# Altium project openbook.PrjPCB (part 2 of 4)

## Sheet p04_cpu_2_of_3_usb_serial.SchDoc
size 520 x 386 mm
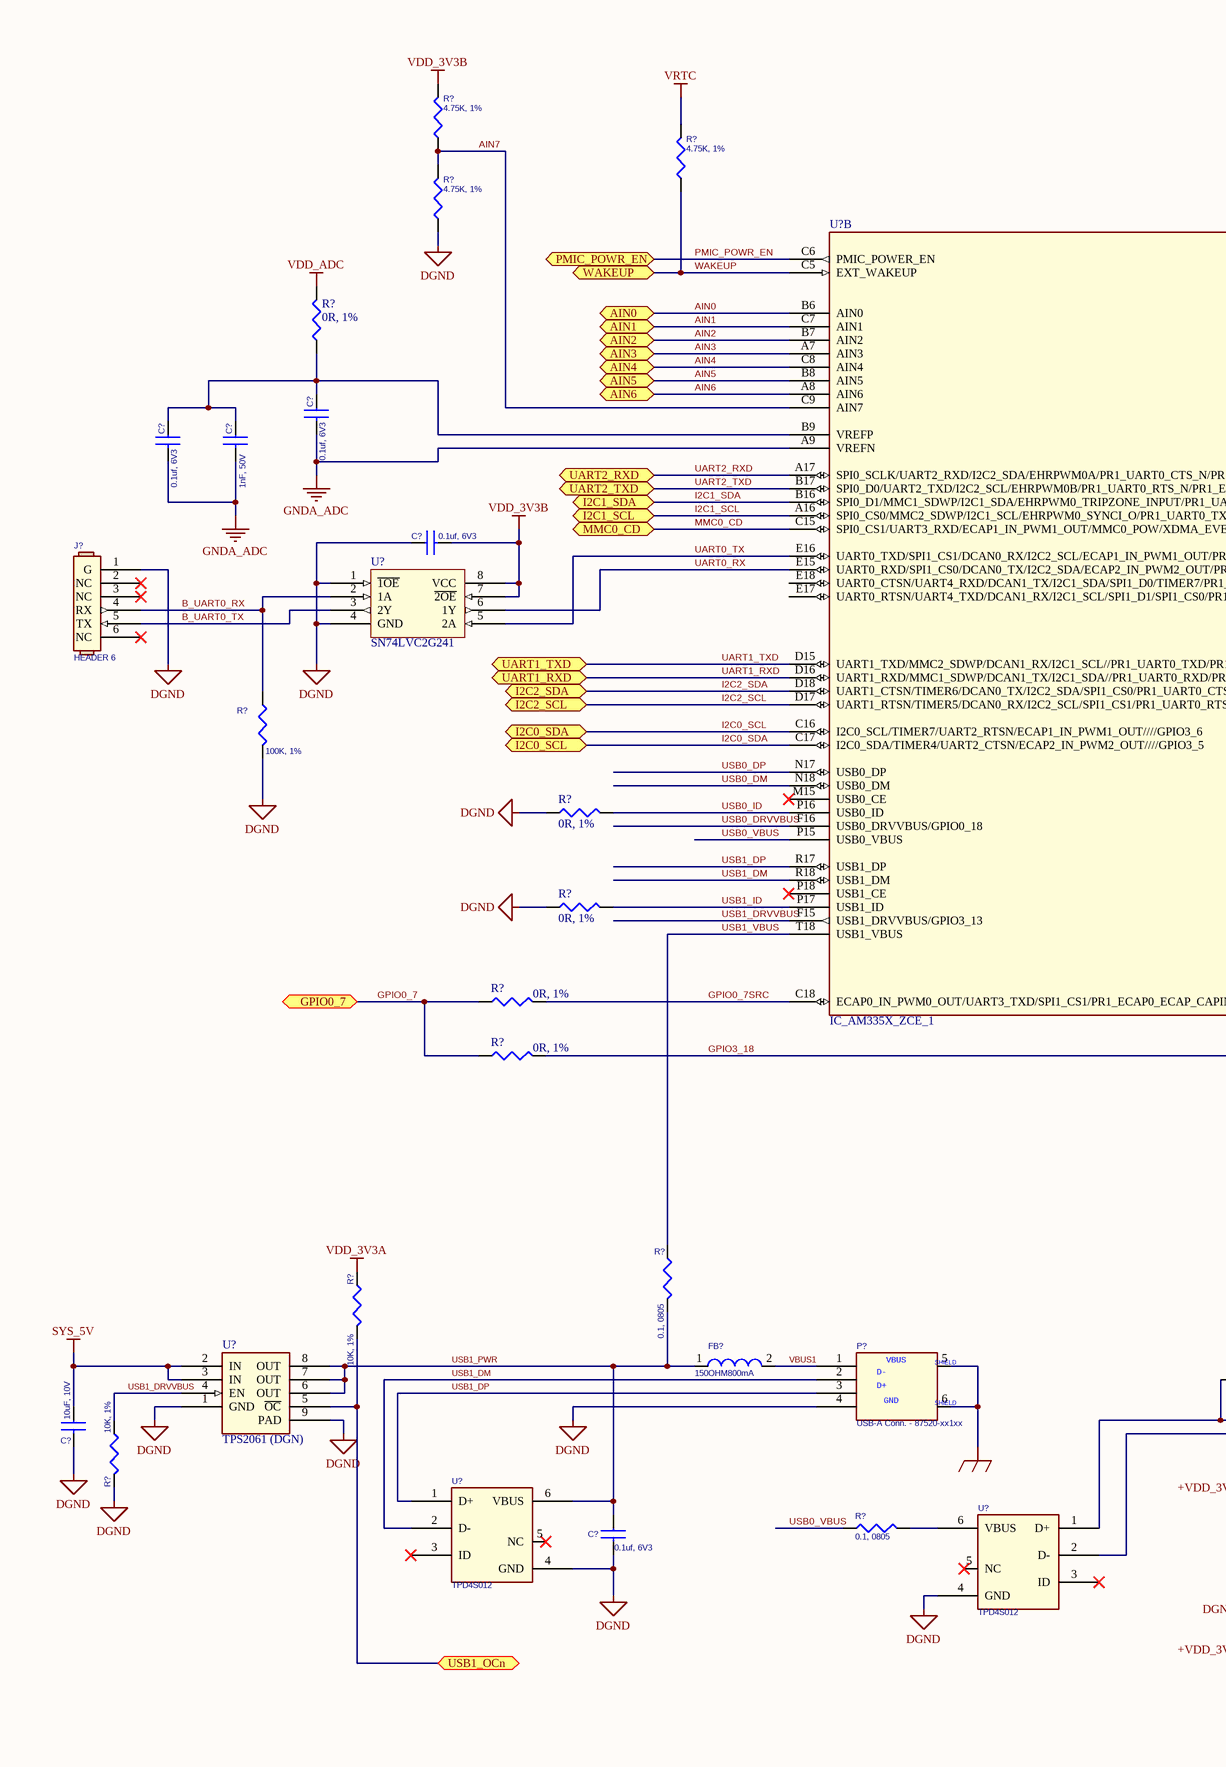
[diagram p3: p04_cpu_2_of_3_usb_serial.SchDoc, left]
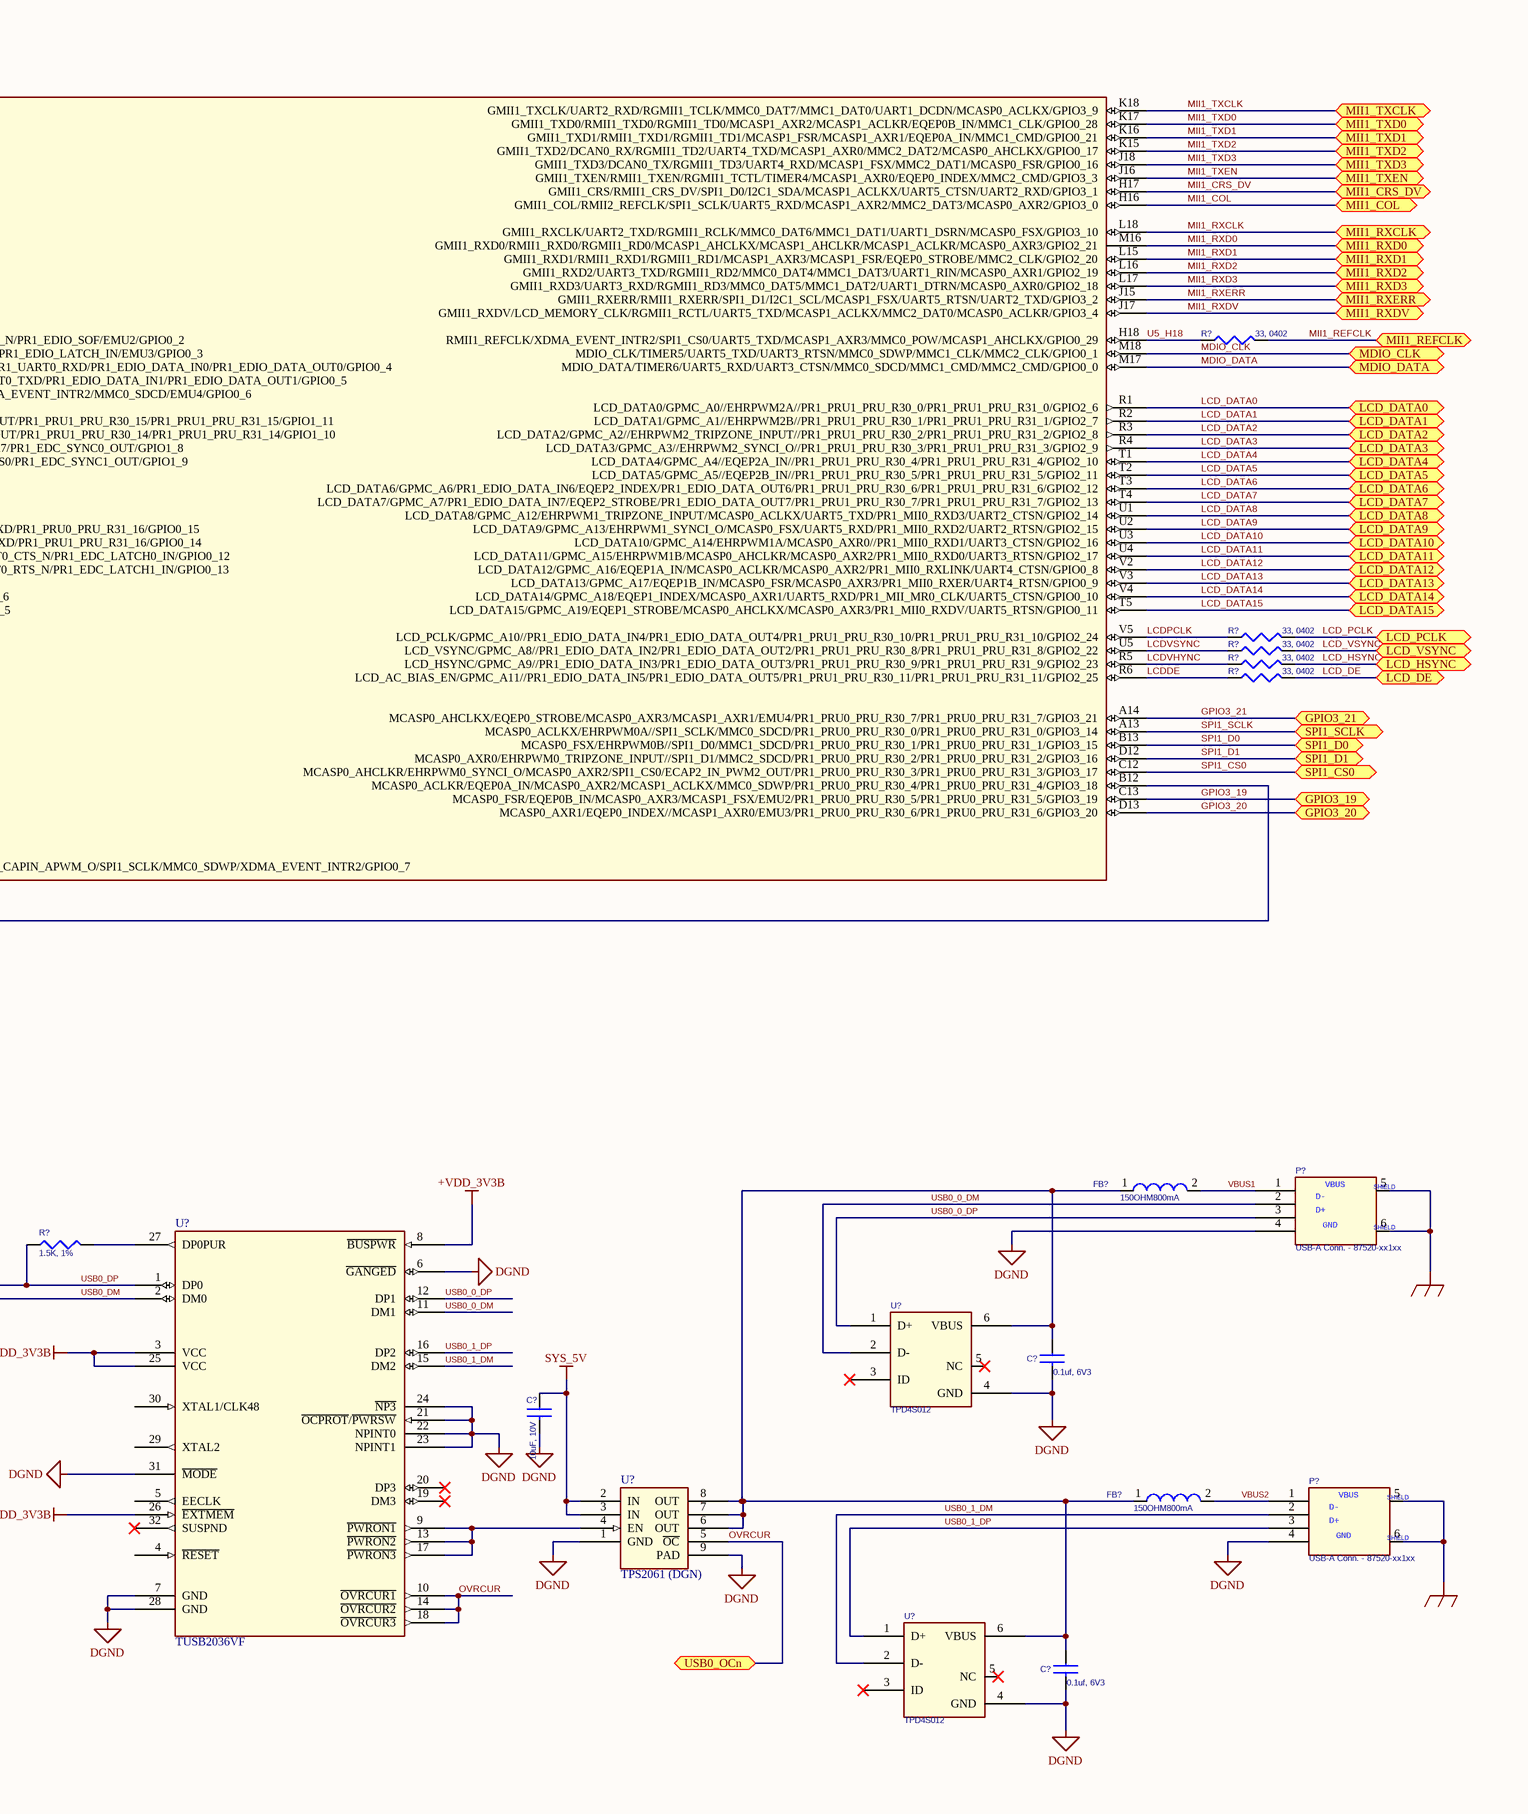
[diagram p4: p04_cpu_2_of_3_usb_serial.SchDoc, right]

### Parts
(Parts that share a designator on the sheet are numbered #1, #2 ... from top to bottom, then left to right.)
C?#29  0.1uf, 6V3  [402]
C?#30  0.1uf, 6V3  [402]
C?#31  1nF, 50V  [402]
C?#32  0.1uf, 6V3  [402]
C?#33  10uF, 10V  [805]
C?#34  0.1uf, 6V3  [402]
C?#35  0.1uf, 6V3  [402]
C?#36  10uF, 10V  [805]
C?#37  0.1uf, 6V3  [402]
FB?#1  150OHM800mA  [SM-7351-IND-0805]
FB?#2  150OHM800mA  [SM-7351-IND-0805]
FB?#3  150OHM800mA  [SM-7351-IND-0805]
J?  HEADER 6  [SIP6]
P?#3  USB-A Conn. - 87520-xx1xx  [usb_a_sh]
P?#4  USB-A Conn. - 87520-xx1xx  [usb_a_sh]
P?#5  USB-A Conn. - 87520-xx1xx  [usb_a_sh]
R?#26  4.75K, 1%  [402]
R?#27  4.75K, 1%  [402]
R?#28  4.75K, 1%  [402]
R?#29  0R, 1%  [402]
R?#30  33, 0402  [402]
R?#31  100K, 1%  [402]
R?#32  33, 0402  [402]
R?#33  33, 0402  [402]
R?#34  33, 0402  [402]
R?#35  0R, 1%  [402]
R?#36  33, 0402  [402]
R?#37  0R, 1%  [402]
R?#38  0R, 1%  [402]
R?#39  0R, 1%  [402]
R?#40  0.1, 0805  [805]
R?#41  10K, 1%  [402]
R?#42  1.5K, 1%  [402]
R?#43  10K, 1%  [402]
R?#44  0.1, 0805  [805]
U?#6  IC_AM335X_ZCE_1  [am33xx_15x15]  (part B of 3)
U?#7  SN74LVC2G241  [U_8_DCU]
U?#8  TPS2061 (DGN)  [DGN-16X60]
U?#9  TUSB2036VF  [LQFP32]
U?#10  TPD4S012  [U_6_DRY]
U?#11  TPD4S012  [U_6_DRY]
U?#12  TPD4S012  [U_6_DRY]
U?#13  TPS2061 (DGN)  [DGN-16X60]
U?#14  TPD4S012  [U_6_DRY]

### Ports
AIN0, AIN1, AIN2, AIN3, AIN4, AIN5, AIN6, GPIO0_7, GPIO3_19, GPIO3_20, GPIO3_21, I2C0_SCL, I2C0_SDA, I2C1_SCL, I2C1_SDA, I2C2_SCL, I2C2_SDA, LCD_DATA0, LCD_DATA1, LCD_DATA2, LCD_DATA3, LCD_DATA4, LCD_DATA5, LCD_DATA6, LCD_DATA7, LCD_DATA8, LCD_DATA9, LCD_DATA10, LCD_DATA11, LCD_DATA12, LCD_DATA13, LCD_DATA14, LCD_DATA15, LCD_DE, LCD_HSYNC, LCD_PCLK, LCD_VSYNC, MDIO_CLK, MDIO_DATA, MII1_COL, MII1_CRS_DV, MII1_REFCLK, MII1_RXCLK, MII1_RXD0, MII1_RXD1, MII1_RXD2, MII1_RXD3, MII1_RXDV, MII1_RXERR, MII1_TXCLK, MII1_TXD0, MII1_TXD1, MII1_TXD2, MII1_TXD3, MII1_TXEN, MMC0_CD, PMIC_POWR_EN, SPI1_CS0, SPI1_D0, SPI1_D1, SPI1_SCLK, UART1_RXD, UART1_TXD, UART2_RXD, UART2_TXD, USB0_OCn, USB1_OCn, WAKEUP

### Nets
+VDD_3V3B: U?#9.3(VCC) U?#9.8(~{BUSPWR}) U?#9.25(VCC) U?#9.26(~{EXTMEM})
DGND: C?#32.1 C?#33.2 C?#34.2 C?#35.2 C?#36.2 C?#37.2 J?.1(G) P?#3.4(P4) P?#4.4(P4) P?#5.4(P4) R?#28.1 R?#31.2 R?#35.1 R?#37.1 R?#43.2 U?#7.1(~{1OE}) U?#7.4(GND) U?#8.1(GND) U?#8.9(PAD) U?#9.6(~{GANGED}) U?#9.7(GND) U?#9.21(~{OCPROT}/~{PWRSW}) U?#9.22(NPINT0) U?#9.23(NPINT1) U?#9.24(~{NP3}) U?#9.28(GND) U?#9.31(~{MODE}) U?#10.4(GND) U?#11.4(GND) U?#12.4(GND) U?#13.1(GND) U?#13.9(PAD) U?#14.4(GND)
GND_EARTH: P?#3.5(SHELD1) P?#3.6(PAD4) P?#4.5(SHELD1) P?#4.6(PAD4) P?#5.5(SHELD1) P?#5.6(PAD4)
GNDA_ADC: C?#29.2 C?#30.2 C?#31.2 U?#6.A9(VREFN)
SYS_5V: C?#33.1 C?#36.1 U?#8.2(IN) U?#8.3(IN) U?#13.2(IN) U?#13.3(IN)
VDD_3V3A: R?#41.1
VDD_3V3B: C?#32.2 R?#26.2 U?#7.7(~{2OE}) U?#7.8(VCC)
VDD_ADC: R?#29.2
VRTC: R?#27.2
AIN0: U?#6.B6(AIN0) ; port AIN0
AIN1: U?#6.C7(AIN1) ; port AIN1
AIN2: U?#6.B7(AIN2) ; port AIN2
AIN3: U?#6.A7(AIN3) ; port AIN3
AIN4: U?#6.C8(AIN4) ; port AIN4
AIN5: U?#6.B8(AIN5) ; port AIN5
AIN6: U?#6.A8(AIN6) ; port AIN6
AIN7: R?#26.1 R?#28.2 U?#6.C9(AIN7)
B_UART0_RX: J?.4(RX) R?#31.1 U?#7.2(1A)
B_UART0_TX: J?.5(TX) U?#7.3(2Y)
GPIO0_7: R?#38.1 R?#39.1 ; port GPIO0_7
GPIO0_7SRC: R?#38.2 U?#6.C18(ECAP0_IN_PWM0_OUT/UART3_TXD/SPI1_CS1/PR1_ECAP0_ECAP_CAPIN_APWM_O/SPI1_SCLK/MMC0_SDWP/XDMA_EVENT_INTR2/GPIO0_7)
GPIO3_18: R?#39.2 U?#6.B12(MCASP0_ACLKR/EQEP0A_IN/MCASP0_AXR2/MCASP1_ACLKX/MMC0_SDWP/PR1_PRU0_PRU_R30_4/PR1_PRU0_PRU_R31_4/GPIO3_18)
GPIO3_19: U?#6.C13(MCASP0_FSR/EQEP0B_IN/MCASP0_AXR3/MCASP1_FSX/EMU2/PR1_PRU0_PRU_R30_5/PR1_PRU0_PRU_R31_5/GPIO3_19) ; port GPIO3_19
GPIO3_20: U?#6.D13(MCASP0_AXR1/EQEP0_INDEX//MCASP1_AXR0/EMU3/PR1_PRU0_PRU_R30_6/PR1_PRU0_PRU_R31_6/GPIO3_20) ; port GPIO3_20
GPIO3_21: U?#6.A14(MCASP0_AHCLKX/EQEP0_STROBE/MCASP0_AXR3/MCASP1_AXR1/EMU4/PR1_PRU0_PRU_R30_7/PR1_PRU0_PRU_R31_7/GPIO3_21) ; port GPIO3_21
I2C0_SCL: U?#6.C16(I2C0_SCL/TIMER7/UART2_RTSN/ECAP1_IN_PWM1_OUT////GPIO3_6) ; port I2C0_SDA
I2C0_SDA: U?#6.C17(I2C0_SDA/TIMER4/UART2_CTSN/ECAP2_IN_PWM2_OUT////GPIO3_5) ; port I2C0_SCL  [project net I2C0_SCL]
I2C1_SCL: U?#6.A16(SPI0_CS0/MMC2_SDWP/I2C1_SCL/EHRPWM0_SYNCI_O/PR1_UART0_TXD/PR1_EDIO_DATA_IN1/PR1_EDIO_DATA_OUT1/GPIO0_5) ; port I2C1_SCL
I2C1_SDA: U?#6.B16(SPI0_D1/MMC1_SDWP/I2C1_SDA/EHRPWM0_TRIPZONE_INPUT/PR1_UART0_RXD/PR1_EDIO_DATA_IN0/PR1_EDIO_DATA_OUT0/GPIO0_4) ; port I2C1_SDA
I2C2_SCL: U?#6.D17(UART1_RTSN/TIMER5/DCAN0_RX/I2C2_SCL/SPI1_CS1/PR1_UART0_RTS_N/PR1_EDC_LATCH1_IN/GPIO0_13) ; port I2C2_SCL
I2C2_SDA: U?#6.D18(UART1_CTSN/TIMER6/DCAN0_TX/I2C2_SDA/SPI1_CS0/PR1_UART0_CTS_N/PR1_EDC_LATCH0_IN/GPIO0_12) ; port I2C2_SDA
LCD_DATA0: U?#6.R1(LCD_DATA0/GPMC_A0//EHRPWM2A//PR1_PRU1_PRU_R30_0/PR1_PRU1_PRU_R31_0/GPIO2_6) ; port LCD_DATA0
LCD_DATA1: U?#6.R2(LCD_DATA1/GPMC_A1//EHRPWM2B//PR1_PRU1_PRU_R30_1/PR1_PRU1_PRU_R31_1/GPIO2_7) ; port LCD_DATA1
LCD_DATA2: U?#6.R3(LCD_DATA2/GPMC_A2//EHRPWM2_TRIPZONE_INPUT//PR1_PRU1_PRU_R30_2/PR1_PRU1_PRU_R31_2/GPIO2_8) ; port LCD_DATA2
LCD_DATA3: U?#6.R4(LCD_DATA3/GPMC_A3//EHRPWM2_SYNCI_O//PR1_PRU1_PRU_R30_3/PR1_PRU1_PRU_R31_3/GPIO2_9) ; port LCD_DATA3
LCD_DATA4: U?#6.T1(LCD_DATA4/GPMC_A4//EQEP2A_IN//PR1_PRU1_PRU_R30_4/PR1_PRU1_PRU_R31_4/GPIO2_10) ; port LCD_DATA4
LCD_DATA5: U?#6.T2(LCD_DATA5/GPMC_A5//EQEP2B_IN//PR1_PRU1_PRU_R30_5/PR1_PRU1_PRU_R31_5/GPIO2_11) ; port LCD_DATA5
LCD_DATA6: U?#6.T3(LCD_DATA6/GPMC_A6/PR1_EDIO_DATA_IN6/EQEP2_INDEX/PR1_EDIO_DATA_OUT6/PR1_PRU1_PRU_R30_6/PR1_PRU1_PRU_R31_6/GPIO2_12) ; port LCD_DATA6
LCD_DATA7: U?#6.T4(LCD_DATA7/GPMC_A7/PR1_EDIO_DATA_IN7/EQEP2_STROBE/PR1_EDIO_DATA_OUT7/PR1_PRU1_PRU_R30_7/PR1_PRU1_PRU_R31_7/GPIO2_13) ; port LCD_DATA7
LCD_DATA8: U?#6.U1(LCD_DATA8/GPMC_A12/EHRPWM1_TRIPZONE_INPUT/MCASP0_ACLKX/UART5_TXD/PR1_MII0_RXD3/UART2_CTSN/GPIO2_14) ; port LCD_DATA8
LCD_DATA9: U?#6.U2(LCD_DATA9/GPMC_A13/EHRPWM1_SYNCI_O/MCASP0_FSX/UART5_RXD/PR1_MII0_RXD2/UART2_RTSN/GPIO2_15) ; port LCD_DATA9
LCD_DATA10: U?#6.U3(LCD_DATA10/GPMC_A14/EHRPWM1A/MCASP0_AXR0//PR1_MII0_RXD1/UART3_CTSN/GPIO2_16) ; port LCD_DATA10
LCD_DATA11: U?#6.U4(LCD_DATA11/GPMC_A15/EHRPWM1B/MCASP0_AHCLKR/MCASP0_AXR2/PR1_MII0_RXD0/UART3_RTSN/GPIO2_17) ; port LCD_DATA11
LCD_DATA12: U?#6.V2(LCD_DATA12/GPMC_A16/EQEP1A_IN/MCASP0_ACLKR/MCASP0_AXR2/PR1_MII0_RXLINK/UART4_CTSN/GPIO0_8) ; port LCD_DATA12
LCD_DATA13: U?#6.V3(LCD_DATA13/GPMC_A17/EQEP1B_IN/MCASP0_FSR/MCASP0_AXR3/PR1_MII0_RXER/UART4_RTSN/GPIO0_9) ; port LCD_DATA13
LCD_DATA14: U?#6.V4(LCD_DATA14/GPMC_A18/EQEP1_INDEX/MCASP0_AXR1/UART5_RXD/PR1_MII_MR0_CLK/UART5_CTSN/GPIO0_10) ; port LCD_DATA14
LCD_DATA15: U?#6.T5(LCD_DATA15/GPMC_A19/EQEP1_STROBE/MCASP0_AHCLKX/MCASP0_AXR3/PR1_MII0_RXDV/UART5_RTSN/GPIO0_11) ; port LCD_DATA15
LCD_DE: R?#36.2 ; port LCD_DE
LCD_HSYNC: R?#34.2 ; port LCD_HSYNC
LCD_PCLK: R?#32.2 ; port LCD_PCLK
LCD_VSYNC: R?#33.2 ; port LCD_VSYNC
LCDDE: R?#36.1 U?#6.R6(LCD_AC_BIAS_EN/GPMC_A11//PR1_EDIO_DATA_IN5/PR1_EDIO_DATA_OUT5/PR1_PRU1_PRU_R30_11/PR1_PRU1_PRU_R31_11/GPIO2_25)
LCDPCLK: R?#32.1 U?#6.V5(LCD_PCLK/GPMC_A10//PR1_EDIO_DATA_IN4/PR1_EDIO_DATA_OUT4/PR1_PRU1_PRU_R30_10/PR1_PRU1_PRU_R31_10/GPIO2_24)
LCDVHYNC: R?#34.1 U?#6.R5(LCD_HSYNC/GPMC_A9//PR1_EDIO_DATA_IN3/PR1_EDIO_DATA_OUT3/PR1_PRU1_PRU_R30_9/PR1_PRU1_PRU_R31_9/GPIO2_23)
LCDVSYNC: R?#33.1 U?#6.U5(LCD_VSYNC/GPMC_A8//PR1_EDIO_DATA_IN2/PR1_EDIO_DATA_OUT2/PR1_PRU1_PRU_R30_8/PR1_PRU1_PRU_R31_8/GPIO2_22)
MDIO_CLK: U?#6.M18(MDIO_CLK/TIMER5/UART5_TXD/UART3_RTSN/MMC0_SDWP/MMC1_CLK/MMC2_CLK/GPIO0_1) ; port MDIO_CLK
MDIO_DATA: U?#6.M17(MDIO_DATA/TIMER6/UART5_RXD/UART3_CTSN/MMC0_SDCD/MMC1_CMD/MMC2_CMD/GPIO0_0) ; port MDIO_DATA
MII1_COL: U?#6.H16(GMII1_COL/RMII2_REFCLK/SPI1_SCLK/UART5_RXD/MCASP1_AXR2/MMC2_DAT3/MCASP0_AXR2/GPIO3_0) ; port MII1_COL
MII1_CRS_DV: U?#6.H17(GMII1_CRS/RMII1_CRS_DV/SPI1_D0/I2C1_SDA/MCASP1_ACLKX/UART5_CTSN/UART2_RXD/GPIO3_1) ; port MII1_CRS_DV
MII1_REFCLK: R?#30.2 ; port MII1_REFCLK
MII1_RXCLK: U?#6.L18(GMII1_RXCLK/UART2_TXD/RGMII1_RCLK/MMC0_DAT6/MMC1_DAT1/UART1_DSRN/MCASP0_FSX/GPIO3_10) ; port MII1_RXCLK
MII1_RXD0: U?#6.M16(GMII1_RXD0/RMII1_RXD0/RGMII1_RD0/MCASP1_AHCLKX/MCASP1_AHCLKR/MCASP1_ACLKR/MCASP0_AXR3/GPIO2_21) ; port MII1_RXD0
MII1_RXD1: U?#6.L15(GMII1_RXD1/RMII1_RXD1/RGMII1_RD1/MCASP1_AXR3/MCASP1_FSR/EQEP0_STROBE/MMC2_CLK/GPIO2_20) ; port MII1_RXD1
MII1_RXD2: U?#6.L16(GMII1_RXD2/UART3_TXD/RGMII1_RD2/MMC0_DAT4/MMC1_DAT3/UART1_RIN/MCASP0_AXR1/GPIO2_19) ; port MII1_RXD2
MII1_RXD3: U?#6.L17(GMII1_RXD3/UART3_RXD/RGMII1_RD3/MMC0_DAT5/MMC1_DAT2/UART1_DTRN/MCASP0_AXR0/GPIO2_18) ; port MII1_RXD3
MII1_RXDV: U?#6.J17(GMII1_RXDV/LCD_MEMORY_CLK/RGMII1_RCTL/UART5_TXD/MCASP1_ACLKX/MMC2_DAT0/MCASP0_ACLKR/GPIO3_4) ; port MII1_RXDV
MII1_RXERR: U?#6.J15(GMII1_RXERR/RMII1_RXERR/SPI1_D1/I2C1_SCL/MCASP1_FSX/UART5_RTSN/UART2_TXD/GPIO3_2) ; port MII1_RXERR
MII1_TXCLK: U?#6.K18(GMII1_TXCLK/UART2_RXD/RGMII1_TCLK/MMC0_DAT7/MMC1_DAT0/UART1_DCDN/MCASP0_ACLKX/GPIO3_9) ; port MII1_TXCLK
MII1_TXD0: U?#6.K17(GMII1_TXD0/RMII1_TXD0/RGMII1_TD0/MCASP1_AXR2/MCASP1_ACLKR/EQEP0B_IN/MMC1_CLK/GPIO0_28) ; port MII1_TXD0
MII1_TXD1: U?#6.K16(GMII1_TXD1/RMII1_TXD1/RGMII1_TD1/MCASP1_FSR/MCASP1_AXR1/EQEP0A_IN/MMC1_CMD/GPIO0_21) ; port MII1_TXD1
MII1_TXD2: U?#6.K15(GMII1_TXD2/DCAN0_RX/RGMII1_TD2/UART4_TXD/MCASP1_AXR0/MMC2_DAT2/MCASP0_AHCLKX/GPIO0_17) ; port MII1_TXD2
MII1_TXD3: U?#6.J18(GMII1_TXD3/DCAN0_TX/RGMII1_TD3/UART4_RXD/MCASP1_FSX/MMC2_DAT1/MCASP0_FSR/GPIO0_16) ; port MII1_TXD3
MII1_TXEN: U?#6.J16(GMII1_TXEN/RMII1_TXEN/RGMII1_TCTL/TIMER4/MCASP1_AXR0/EQEP0_INDEX/MMC2_CMD/GPIO3_3) ; port MII1_TXEN
MMC0_CD: U?#6.C15(SPI0_CS1/UART3_RXD/ECAP1_IN_PWM1_OUT/MMC0_POW/XDMA_EVENT_INTR2/MMC0_SDCD/EMU4/GPIO0_6) ; port MMC0_CD
OVRCUR: U?#9.10(~{OVRCUR1}) U?#9.14(~{OVRCUR2}) U?#9.18(~{OVRCUR3}) U?#13.5(~{OC}) ; port USB0_OCn
PMIC_POWR_EN: U?#6.C6(PMIC_POWER_EN) ; port PMIC_POWR_EN
SPI1_CS0: U?#6.C12(MCASP0_AHCLKR/EHRPWM0_SYNCI_O/MCASP0_AXR2/SPI1_CS0/ECAP2_IN_PWM2_OUT/PR1_PRU0_PRU_R30_3/PR1_PRU0_PRU_R31_3/GPIO3_17) ; port SPI1_CS0
SPI1_D0: U?#6.B13(MCASP0_FSX/EHRPWM0B//SPI1_D0/MMC1_SDCD/PR1_PRU0_PRU_R30_1/PR1_PRU0_PRU_R31_1/GPIO3_15) ; port SPI1_D0
SPI1_D1: U?#6.D12(MCASP0_AXR0/EHRPWM0_TRIPZONE_INPUT//SPI1_D1/MMC2_SDCD/PR1_PRU0_PRU_R30_2/PR1_PRU0_PRU_R31_2/GPIO3_16) ; port SPI1_D1
SPI1_SCLK: U?#6.A13(MCASP0_ACLKX/EHRPWM0A//SPI1_SCLK/MMC0_SDCD/PR1_PRU0_PRU_R30_0/PR1_PRU0_PRU_R31_0/GPIO3_14) ; port SPI1_SCLK
U5_H18: R?#30.1 U?#6.H18(RMII1_REFCLK/XDMA_EVENT_INTR2/SPI1_CS0/UART5_TXD/MCASP1_AXR3/MMC0_POW/MCASP1_AHCLKX/GPIO0_29)
UART0_RX: U?#6.E15(UART0_RXD/SPI1_CS0/DCAN0_TX/I2C2_SDA/ECAP2_IN_PWM2_OUT/PR1_PRU1_PRU_R30_14/PR1_PRU1_PRU_R31_14/GPIO1_10) U?#7.6(1Y)
UART0_TX: U?#6.E16(UART0_TXD/SPI1_CS1/DCAN0_RX/I2C2_SCL/ECAP1_IN_PWM1_OUT/PR1_PRU1_PRU_R30_15/PR1_PRU1_PRU_R31_15/GPIO1_11) U?#7.5(2A)
UART1_RXD: U?#6.D16(UART1_RXD/MMC1_SDWP/DCAN1_TX/I2C1_SDA//PR1_UART0_RXD/PR1_PRU1_PRU_R31_16/GPIO0_14) ; port UART1_RXD
UART1_TXD: U?#6.D15(UART1_TXD/MMC2_SDWP/DCAN1_RX/I2C1_SCL//PR1_UART0_TXD/PR1_PRU0_PRU_R31_16/GPIO0_15) ; port UART1_TXD
UART2_RXD: U?#6.A17(SPI0_SCLK/UART2_RXD/I2C2_SDA/EHRPWM0A/PR1_UART0_CTS_N/PR1_EDIO_SOF/EMU2/GPIO0_2) ; port UART2_RXD
UART2_TXD: U?#6.B17(SPI0_D0/UART2_TXD/I2C2_SCL/EHRPWM0B/PR1_UART0_RTS_N/PR1_EDIO_LATCH_IN/EMU3/GPIO0_3) ; port UART2_TXD
USB0_0_DM: P?#3.2(P2) U?#9.11(DM1) U?#10.2(D-)
USB0_0_DP: P?#3.3(P3) U?#9.12(DP1) U?#10.1(D+)
USB0_1_DM: P?#5.2(P2) U?#9.15(DM2) U?#14.2(D-)
USB0_1_DP: P?#5.3(P3) U?#9.16(DP2) U?#14.1(D+)
USB0_DM: U?#6.N18(USB0_DM) U?#9.2(DM0) U?#12.2(D-)
USB0_DP: R?#42.1 U?#6.N17(USB0_DP) U?#9.1(DP0) U?#12.1(D+)
USB0_DRVVBUS: U?#6.F16(USB0_DRVVBUS/GPIO0_18)
USB0_ID: R?#35.2 U?#6.P16(USB0_ID)
USB0_VBUS: R?#44.1 U?#6.P15(USB0_VBUS)
USB1_DM: P?#4.2(P2) U?#6.R18(USB1_DM) U?#11.2(D-)
USB1_DP: P?#4.3(P3) U?#6.R17(USB1_DP) U?#11.1(D+)
USB1_DRVVBUS: R?#43.1 U?#6.F15(USB1_DRVVBUS/GPIO3_13) U?#8.4(EN)
USB1_ID: R?#37.2 U?#6.P17(USB1_ID)
USB1_PWR: C?#35.1 FB?#2.1 R?#40.2 U?#8.6(OUT) U?#8.7(OUT) U?#8.8(OUT) U?#11.6(VBUS)
USB1_VBUS: R?#40.1 U?#6.T18(USB1_VBUS)
VBUS1: FB?#1.2 FB?#2.2 P?#3.1(P1) P?#4.1(P1)
VBUS2: FB?#3.2 P?#5.1(P1)
WAKEUP: R?#27.1 U?#6.C5(EXT_WAKEUP) ; port WAKEUP
NetC?#29_1: C?#29.1 C?#30.1 C?#31.1 R?#29.1 U?#6.B9(VREFP)
NetC?#34_1: C?#34.1 C?#37.1 FB?#1.1 FB?#3.1 U?#10.6(VBUS) U?#13.6(OUT) U?#13.7(OUT) U?#13.8(OUT) U?#14.6(VBUS)
NetR?#41_2: R?#41.2 U?#8.5(~{OC}) ; port USB1_OCn
NetR?#42_2: R?#42.2 U?#9.27(DP0PUR)
NetR?#44_2: R?#44.2 U?#12.6(VBUS)
NetU?#9_9: U?#9.9(~{PWRON1}) U?#9.13(~{PWRON2}) U?#9.17(~{PWRON3}) U?#13.4(EN)

Not connected (* = marked no-connect by the designer): J? 2(NC)* 3(NC)* 6(NC)*; U?#6 E17(UART0_RTSN/UART4_TXD/DCAN1_RX/I2C1_SCL/SPI1_D1/SPI1_CS0/PR1_EDC_SYNC1_OUT/GPIO1_9) E18(UART0_CTSN/UART4_RXD/DCAN1_TX/I2C1_SDA/SPI1_D0/TIMER7/PR1_EDC_SYNC0_OUT/GPIO1_8) M15(USB0_CE)* P18(USB1_CE)*; U?#9 4(~{RESET}) 5(EECLK) 19(DM3)* 20(DP3)* 29(XTAL2) 30(XTAL1/CLK48) 32(SUSPND)*; U?#10 3(ID)* 5(NC)*; U?#11 3(ID)* 5(NC)*; U?#12 3(ID)* 5(NC)*; U?#14 3(ID)* 5(NC)*

### Notes on the sheet
- (in symbol CONN_54819-0578_2) VBUS; SHIELD; D-; D+; GND

### Library data of the parts
C?#29 C?#30 C?#32 C?#34 C?#35 C?#37 = CAP_0.1uF_X7R_16V_10% 0402: CAP CER 0.1UF 6.3V 10% X5R 0402; Manufacturer: TDK Corporation; Manufacturer Part Number: C1005X5R0J104K050BA; Capacitance: 0.1µF; Applications: General Purpose; Category: Capacitors; ComponentLink1Description: http://www.kemet.com/datasheets&C0402C104K4RACTU; ComponentLink1URL: http://www.kemet.com/datasheets&C0402C104K4RACTU; Features: -; Height - Seated (Max): -; Lead Spacing: -; Lead Style: -; Mounting Type: Surface Mount, MLCC; Operating Temperature: -55°C ~ 85°C; Package / Case: 0402 (1005 Metric); Packaging: Digi-Reel®; Pricing 1: 1=0.1, 10=0.026, 100=0.0121, 250=0.00992, 500=0.00848, 1000=0.0066, 5000=0.0055 (USD); Ratings: -; RoHS: RoHS Compliant; Size / Dimension: 0.039" L x 0.020" W (1.00mm x 0.50mm); Stock 1: 127604; Supplier 1: Digi-Key; Supplier Part Number 1: 445-1266-6-ND; Temperature Coefficient: X5R; Thickness (Max): 0.022" (0.55mm); Tolerance: ±10%; Voltage - Rated: 6.3V
C?#31 = CAP_0.001_X7R_50V_5%_0402: CAP CER 1000PF 16V 10% X7R 0402; Manufacturer: Yageo; Manufacturer Part Number: CC0402KRX7R7BB102; Supplier 1: Digi-Key; Supplier Part Number 1: 311-1352-6-ND; RoHS: RoHS Compliant; Category: Capacitors; Stock 1: 394472; Pricing 1: 1=0.1, 10=0.012, 25=0.0088, 100=0.0057, 250=0.00464, 500=0.00396, 1000=0.00309, 2500=0.00278, 5000=0.00258 (USD); Capacitance: 1000pF; Voltage - Rated: 16V; Tolerance: ±10%; Temperature Coefficient: X7R; Mounting Type: Surface Mount, MLCC; Operating Temperature: -55°C ~ 125°C; Applications: General Purpose; Ratings: -; Package / Case: 0402 (1005 Metric); Size / Dimension: 0.039" L x 0.020" W (1.00mm x 0.50mm); Height - Seated (Max): -; Thickness (Max): 0.022" (0.55mm); Lead Spacing: -; Features: -; Packaging: Digi-Reel®; Lead Style: -; ComponentLink1URL: http://www.yageo.com/documents/recent/UPY-GPHC_X7R_6.3V-to-50V_8.pdf; ComponentLink1Description: http://www.yageo.com/documents/recent/UPY-GPHC_X7R_6.3V-to-50V_8.pdf
C?#33 C?#36 = CAP_10uF_Y5V_10V_10%_0805: CAP CER 10UF 10V Y5V 0805; Manufacturer: TDK Corporation; Manufacturer Part Number: C2012Y5V1A106Z; Capacitance: 10µF; Tolerance: -20%, +80%; Temperature Coefficient: Y5V (F); Supplier 1: Digi-Key; Supplier Part Number 1: 445-1371-6-ND; RoHS: RoHS Compliant; Category: Capacitors; Stock 1: 123307; Pricing 1: 1=0.15, 10=0.105, 100=0.0499, 250=0.042, 500=0.03518, 1000=0.02887 (USD); Voltage - Rated: 10V; Mounting Type: Surface Mount, MLCC; Operating Temperature: -30°C ~ 85°C; Applications: General Purpose; Ratings: -; Package / Case: 0805 (2012 Metric); Size / Dimension: 0.079" L x 0.049" W (2.00mm x 1.25mm); Height - Seated (Max): -; Thickness (Max): 0.057" (1.45mm); Lead Spacing: -; Features: -; Packaging: Digi-Reel®; Lead Style: -; ComponentLink1URL: http://media.digikey.com/pdf/Data%20Sheets/TDK%20PDFs/C_Series_GeneralAppl_B11.pdf; ComponentLink1Description: http://media.digikey.com/pdf/Data%20Sheets/TDK%20PDFs/C_Series_GeneralAppl_B11.pdf
FB?#1-FB?#3 = FER_180_200_0: FERRITE 800MA 150 OHM 0805 SMD; PartName: FerriteBead150ohm800mA; Mfr: Steward; MfrNum: LI0805H151R-10; TIIntPartnumber: 1L0010; Manufacturer: Laird-Signal Integrity Products; Vendor: Digikey; Impedance @ Frequency: 150 Ohm @ 100MHz; DC Resistance (DCR): 150 mOhm Max; Filter Type: Differential Mode - Single; Supplier 1: Digi-Key; Supplier Part Number 1: 240-2384-6-ND; Manufacturer Part Number: LI0805H151R-10; RoHS: RoHS Compliant; Category: Filters; Stock 1: 3694; Pricing 1: 1=0.1, 10=0.07, 25=0.064, 50=0.0574, 100=0.0421, 250=0.03064, 500=0.02808, 1000=0.02424 (USD); Current Rating: 800mA; Package / Case: 0805 (2012 Metric); Mounting Type: Surface Mount; Packaging: Digi-Reel®; Height (Max): 0.043" (1.10mm); Size / Dimension: 0.079" L x 0.049" W (2.00mm x 1.25mm); ComponentLink1URL: http://www.lairdtech.com/WorkArea/linkit.aspx?LinkIdentifier=id&ItemID=4912; ComponentLink1Description: http://www.lairdtech.com/WorkArea/linkit.aspx?LinkIdentifier=id&ItemID=4912
J? = HDR_6x1: CONN HEADER 6POS, VERTICAL,  .100 STR TIN; Manufacturer: Samtec Inc; Manufacturer Part Number: FTR-110-03-G-D-06; Connector Type: Unshrouded; Number of Positions: 20; Number of Positions Loaded: 19; Pitch: 0.050" (1.27mm); Row Spacing: 0.100" (2.54mm); Supplier 1: Digi-Key; Supplier Part Number 1: FTR-110-03-G-D-06-ND; RoHS: RoHS Compliant; Category: Connectors, Interconnects; Stock 1: 0; Pricing 1: 1=4.47 (USD); Number of Rows: 2; Contact Mating Length: 0.125" (3.18mm); Mounting Type: Surface Mount; Termination: Solder; Features: -; Contact Finish: Gold; Contact Finish Thickness: 10µin (0.25µm); Color: Black; Packaging: Tube; ComponentLink1URL: http://www.samtec.com/documents/webfiles/cpdf/FTR-1XX-XX-XX-D-X-XX-MKT.pdf; ComponentLink1Description: http://www.samtec.com/documents/webfiles/cpdf/FTR-1XX-XX-XX-D-X-XX-MKT.pdf; Height Stacking (Mating): -; Molding Height Above Board: 0.100" (2.54mm)
P?#3-P?#5 = CONN_54819-0578_2: CONN RCPT USB TYPE A R/A PCB; Manufacturer: FCI; Manufacturer Part Number: 87520-0010BLF; CLASS: IO; TN: 224-0234-000; Number of Contacts: 4; Gender: Receptacle; Specifications: USB 2.0; Supplier 1: Digi-Key; Supplier Part Number 1: 609-1045-ND; RoHS: RoHS Compliant; Category: Connectors, Interconnects; Stock 1: 4363; Pricing 1: 1=0.78, 10=0.734, 25=0.6604, 50=0.587, 100=0.5626, 250=0.51368, 500=0.4892, 1000=0.40359, 2500=0.3669 (USD); Connector Type: USB - A; Mounting Type: Through Hole, Right Angle, Horizontal; Features: Board Lock; Packaging: Tube; Ingress Protection: -; ComponentLink1URL: http://portal.fciconnect.com/Comergent//fci/drawing/87520.pdf; ComponentLink1Description: http://portal.fciconnect.com/Comergent//fci/drawing/87520.pdf
R?#26-R?#28 = RES_4.75K_1/16W_1%_0402: RES 4.75K OHM 1/16W 1% 0402 SMD; Manufacturer: Stackpole Electronics Inc; Manufacturer Part Number: RMCF0402FT4K75; Power (Watts): 0.063W, 1/16W; Temperature Coefficient: ±100ppm/°C; Supplier 1: Digi-Key; Supplier Part Number 1: RMCF0402FT4K75DKR-ND; RoHS: RoHS Compliant; Category: Resistors; Stock 1: 280917; Pricing 1: 1=0.04, 10=0.025, 50=0.0138, 100=0.0105, 250=0.0078, 500=0.00576, 1000=0.00384, 2500=0.00324, 5000=0.0027 (USD); Resistance (Ohms): 4.75k; Composition: Thick Film; Features: -; Tolerance: ±1%; Package / Case: 0402 (1005 Metric); Supplier Device Package: 0402; Size / Dimension: 0.039" L x 0.020" W (1.00mm x 0.50mm); Height: 0.016" (0.40mm); Number of Terminations: 2; Packaging: Digi-Reel®; ComponentLink1URL: http://www.seielect.com/Catalog/SEI-RMCF_RMCP.pdf; ComponentLink1Description: http://www.seielect.com/Catalog/SEI-RMCF_RMCP.pdf
R?#29 R?#35 R?#37-R?#39 = RES_0_1/16W_1%_0402: RES 0.0 OHM 1/16W 0402 SMD; Manufacturer: Yageo; Manufacturer Part Number: RC0402JR-070RL; Power (Watts): 0.063W, 1/16W; Resistance (Ohms): 0.0; Tolerance: Jumper; Category: Resistors; ComponentLink1Description: http://www.yageo.com/documents/recent/PYu-RC0402_51_RoHS_L_6.pdf; ComponentLink1URL: http://www.yageo.com/documents/recent/PYu-RC0402_51_RoHS_L_6.pdf; Composition: Thick Film; Features: -; Height: 0.016" (0.40mm); Number of Terminations: 2; Package / Case: 0402 (1005 Metric); Packaging: Digi-Reel®; Pricing 1: 1=0.1, 10=0.012, 25=0.0092, 100=0.0055, 250=0.00476, 500=0.00336, 1000=0.00237, 2500=0.00206, 5000=0.00178 (USD); RoHS: RoHS Compliant; Size / Dimension: 0.039" L x 0.020" W (1.00mm x 0.50mm); Stock 1: 4904429; Supplier 1: Digi-Key; Supplier Device Package: 0402; Supplier Part Number 1: 311-0.0JRDKR-ND; Temperature Coefficient: -
R?#30 R?#32-R?#34 R?#36 = RES_33_0402: RES 33 OHM 1/16W 5% 0402 SMD; Manufacturer: Panasonic Electronic Components; Manufacturer Part Number: ERJ-2GEJ330X; Resistance (Ohms): 33; Power (Watts): 0.1W, 1/10W; Temperature Coefficient: ±200ppm/°C; Supplier 1: Digi-Key; Supplier Part Number 1: P33JDKR-ND; RoHS: RoHS Compliant; Category: Resistors; Stock 1: 5879945; Pricing 1: 1=0.1, 50=0.0172, 100=0.0131, 250=0.00976, 500=0.0072, 1000=0.0048, 5000=0.00338 (USD); Composition: Thick Film; Features: -; Tolerance: ±5%; Package / Case: 0402 (1005 Metric); Supplier Device Package: 0402; Size / Dimension: 0.039" L x 0.020" W (1.00mm x 0.50mm); Height: 0.016" (0.40mm); Number of Terminations: 2; Packaging: Digi-Reel®; ComponentLink1URL: http://industrial.panasonic.com/www-cgi/jvcr13pz.cgi?E+PZ+3+AOA0001+ERJ2GEJ330X+7+WW; ComponentLink1Description: http://industrial.panasonic.com/www-cgi/jvcr13pz.cgi?E+PZ+3+AOA0001+ERJ2GEJ330X+7+WW
R?#31 = RES_100K_1/16W_1%_0402: as R?#1 on sheet p02_power_management; Category: Resistors; ComponentLink1Description: http://www.seielect.com/Catalog/SEI-RMCF_RMCP.pdf; ComponentLink1URL: http://www.seielect.com/Catalog/SEI-RMCF_RMCP.pdf; Composition: Thick Film; Features: -; Height: 0.016" (0.40mm); Number of Terminations: 2; Package / Case: 0402 (1005 Metric); Packaging: Digi-Reel®; Pricing 1: 1=0.04, 10=0.025, 50=0.0138, 100=0.0105, 250=0.0078, 500=0.00576, 1000=0.00384, 2500=0.00324, 5000=0.0027 (USD); Resistance (Ohms): 100k; RoHS: RoHS Compliant; Size / Dimension: 0.039" L x 0.020" W (1.00mm x 0.50mm); Stock 1: 851196; Supplier 1: Digi-Key; Supplier Device Package: 0402; Supplier Part Number 1: RMCF0402FT100KDKR-ND; Tolerance: ±1%
R?#40 R?#44 = RES_0.1_0805: RES .10 OHM 1/8W 5% 0805; Manufacturer: CTS Resistor Products; Manufacturer Part Number: 73L3R10J; Resistance (Ohms): 0.1; Power (Watts): 0.125W, 1/8W; Temperature Coefficient: ±200ppm/°C; Supplier 1: Digi-Key; Supplier Part Number 1: 73L3R10JDKR-ND; RoHS: RoHS Compliant; Category: Resistors; Stock 1: 37057; Pricing 1: 1=0.1, 10=0.066, 100=0.0267, 250=0.0204, 500=0.01632, 1000=0.01201 (USD); Composition: Thick Film; Features: Current Sense; Tolerance: ±5%; Package / Case: 0805 (2012 Metric); Supplier Device Package: 0805; Size / Dimension: 0.079" L x 0.049" W (2.00mm x 1.25mm); Height: 0.026" (0.65mm); Number of Terminations: 2; Packaging: Digi-Reel®; ComponentLink1URL: http://www.ctscorp.com/components/Datasheets/008-0337-0.pdf; ComponentLink1Description: http://www.ctscorp.com/components/Datasheets/008-0337-0.pdf
R?#41 R?#43 = RES_10K_1/16W_1%_0402: RES 10K OHM 1/16W 5% 0402 SMD; Manufacturer: Rohm Semiconductor; Manufacturer Part Number: MCR01MZPJ103; Power (Watts): 0.063W, 1/16W; Temperature Coefficient: ±200ppm/°C; Supplier 1: Digi-Key; Supplier Part Number 1: RHM10KJDKR-ND; RoHS: RoHS Compliant; Category: Resistors; Stock 1: 110842; Pricing 1: 1=0.1, 10=0.019, 25=0.014, 100=0.0078, 250=0.00596, 500=0.00476, 1000=0.0035, 5000=0.00251 (USD); Resistance (Ohms): 10k; Composition: Thick Film; Features: Automotive AEC-Q200 Qualified; Tolerance: ±5%; Package / Case: 0402 (1005 Metric); Supplier Device Package: 0402 (1005 Metric); Size / Dimension: 0.039" L x 0.020" W (1.00mm x 0.50mm); Height: 0.016" (0.40mm); Number of Terminations: 2; Packaging: Digi-Reel®; ComponentLink1URL: http://rohmfs.rohm.com/en/products/databook/datasheet/passive/resistor/chip_resistor/mcr_a.pdf; ComponentLink1Description: http://rohmfs.rohm.com/en/products/databook/datasheet/passive/resistor/chip_resistor/mcr_a.pdf
R?#42 = RES_1.5K_1/16W_5%_0402: RES 1.50K OHM 1/16W 1% 0402 SMD; Manufacturer: Yageo; Manufacturer Part Number: RC0402FR-071K5L; Power (Watts): 0.063W, 1/16W; Temperature Coefficient: ±100ppm/°C; Supplier 1: Digi-Key; Supplier Part Number 1: 311-1.50KLRDKR-ND; RoHS: RoHS Compliant; Category: Resistors; Stock 1: 465266; Pricing 1: 1=0.1, 10=0.014, 25=0.0104, 100=0.0063, 250=0.0054, 500=0.00382, 1000=0.0027, 2500=0.00234, 5000=0.00203 (USD); Resistance (Ohms): 1.5k; Composition: Thick Film; Features: -; Tolerance: ±1%; Package / Case: 0402 (1005 Metric); Supplier Device Package: 0402; Size / Dimension: 0.039" L x 0.020" W (1.00mm x 0.50mm); Height: 0.016" (0.40mm); Number of Terminations: 2; Packaging: Digi-Reel®; ComponentLink1URL: http://www.yageo.com/documents/recent/PYu-RC0402_51_RoHS_L_6.pdf; ComponentLink1Description: http://www.yageo.com/documents/recent/PYu-RC0402_51_RoHS_L_6.pdf
U?#6 = IC_AM335X_ZCE_1: SubArctic Cortex A8 Processor 15x15; Manufacturer: Texas Instruments; Manufacturer Part Number: XAM3359ZCZ; Processor Type: ARM Microprocessor; Voltage: 1.06 V ~ 1.15 V; Supplier 1: Digi-Key; Supplier Part Number 1: 296-35073-ND; RoHS: RoHS Compliant; Category: Integrated Circuits (ICs); Stock 1: 16; Pricing 1: 1=33.5, 10=30.988, 100=26.465, 250=24.28752, 500=23.115, 1000=21.775, 2500=21.105, 5000=20.6025, 10000=20.1 (USD); Features: -; Speed: -; Mounting Type: Surface Mount; Package / Case: 324-LFBGA; Supplier Device Package: 324-NFBGA(15x15); Packaging: Tray; ComponentLink1URL: http://www.ti.com/lit/ds/symlink/am3354.pdf; ComponentLink1Description: http://www.ti.com/lit/ds/symlink/am3354.pdf
U?#7 = SN74LVC2G241: IC BUFF/DVR TRI-ST DL 8VSSOP; Manufacturer: Texas Instruments; Manufacturer Part Number: SN74LVC2G241DCUR; Logic Type: Buffer/Line Driver, Non-Inverting; Number of Elements: 2; Number of Bits per Element: 1; Current - Output High, Low: 32mA, 32mA; Voltage - Supply: 1.65 V ~ 5.5 V; Supplier 1: Digi-Key; Supplier Part Number 1: 296-11936-6-ND; RoHS: RoHS Compliant; Category: Integrated Circuits (ICs); Stock 1: 28602; Pricing 1: 1=0.49, 10=0.428, 25=0.3756 (USD); Operating Temperature: -40°C ~ 85°C; Mounting Type: Surface Mount; Package / Case: 8-VFSOP (0.091", 2.30mm Width); Supplier Device Package: US8; Packaging: Digi-Reel®; ComponentLink1URL: http://www.ti.com/lit/ds/symlink/sn74lvc2g241.pdf; ComponentLink1Description: http://www.ti.com/lit/ds/symlink/sn74lvc2g241.pdf
U?#8 U?#13 = TPS2061: IC 1.5A PWR DIST SWITCH 8-MSOP; Manufacturer: Texas Instruments; Manufacturer Part Number: TPS2061DGN; Number of Outputs: 1; Rds (On): 135 mOhm; Internal Switch(s): Yes; Voltage - Input: 2.7 V ~ 5.5 V; Supplier 1: Digi-Key; RoHS: RoHS Compliant; Category: Integrated Circuits (ICs); Stock 1: 838; Pricing 1: 1=2.33, 10=2.1, 100=1.6875, 250=1.5, 500=1.3125, 1000=1.0875, 2500=1.0125, 5000=0.975, 10000=0.9375 (USD); Packaging: Tube; Type: High Side Switch; Current Limit: 1.5A; Operating Temperature: -40°C ~ 85°C; Mounting Type: Surface Mount; Package / Case: 8-TSSOP, 8-MSOP (0.118", 3.00mm Width) Exposed Pad; Supplier Device Package: 8-MSOP-PowerPad; ComponentLink1URL: http://www.ti.com/lit/ds/symlink/tps2061.pdf; ComponentLink1Description: http://www.ti.com/lit/ds/symlink/tps2061.pdf; Supplier Part Number 1: 296-28041-5-ND
U?#9 = TUSB2036: IC 2/3-PORT USB HUB 32-LQFP; Manufacturer: Texas Instruments; Function: Hub Controller; Standards: USB 2.0; Voltage - Supply: 3 V ~ 3.6 V; Current - Supply: 40mA; Supplier 1: Digi-Key; Manufacturer Part Number: TUSB2036VF; RoHS: RoHS Compliant; Category: Integrated Circuits (ICs); Stock 1: 3045; Pricing 1: 1=3.92, 10=3.5, 25=3.15, 100=2.87, 250=2.59, 500=2.324, 1000=1.96, 2500=1.862, 5000=1.792 (USD); Packaging: Tray; Protocol: USB; Interface: USB; Operating Temperature: 0°C ~ 70°C; Package / Case: 32-LQFP; Supplier Device Package: 32-LQFP (7x7); ComponentLink1URL: http://www.ti.com/lit/ds/symlink/tusb2036.pdf; ComponentLink1Description: http://www.ti.com/lit/ds/symlink/tusb2036.pdf; Supplier Part Number 1: 296-11086-ND
U?#10-U?#12 U?#14 = PROT_TPD4S012: ESD 4channel USB Interface; Mfr: TI; MfrNum: TPD4S012DRY; TIIntPartnumber: 1A0233; Manufacturer: Texas Instruments; Manufacturer Part Number: TPD4S012DRYR; Vendor: Digikey; Cost100: 0.76; Cost10K: 0.23; Power (Watts): 60W; Number of Circuits: 4; PartName: TPD4S012; Supplier 1: Digi-Key; Supplier Part Number 1: 296-24244-6-ND; RoHS: RoHS Compliant; Category: Circuit Protection; Stock 1: 7978; Pricing 1: 1=0.78, 10=0.682, 25=0.6028, 100=0.2552, 250=0.25044, 500=0.2457, 750=0.24097 (USD); Voltage - Working: -; Voltage - Clamping: -; Technology: Mixed Technology; Applications: USB; Package / Case: 6-UFDFN; Supplier Device Package: 6-SON (1.45x1); Packaging: Digi-Reel®; ComponentLink1URL: http://www.ti.com/lit/ds/symlink/tpd4s012.pdf; ComponentLink1Description: http://www.ti.com/lit/ds/symlink/tpd4s012.pdf

## Sheet p05_cpu_3_of_3.SchDoc
size 513 x 386 mm
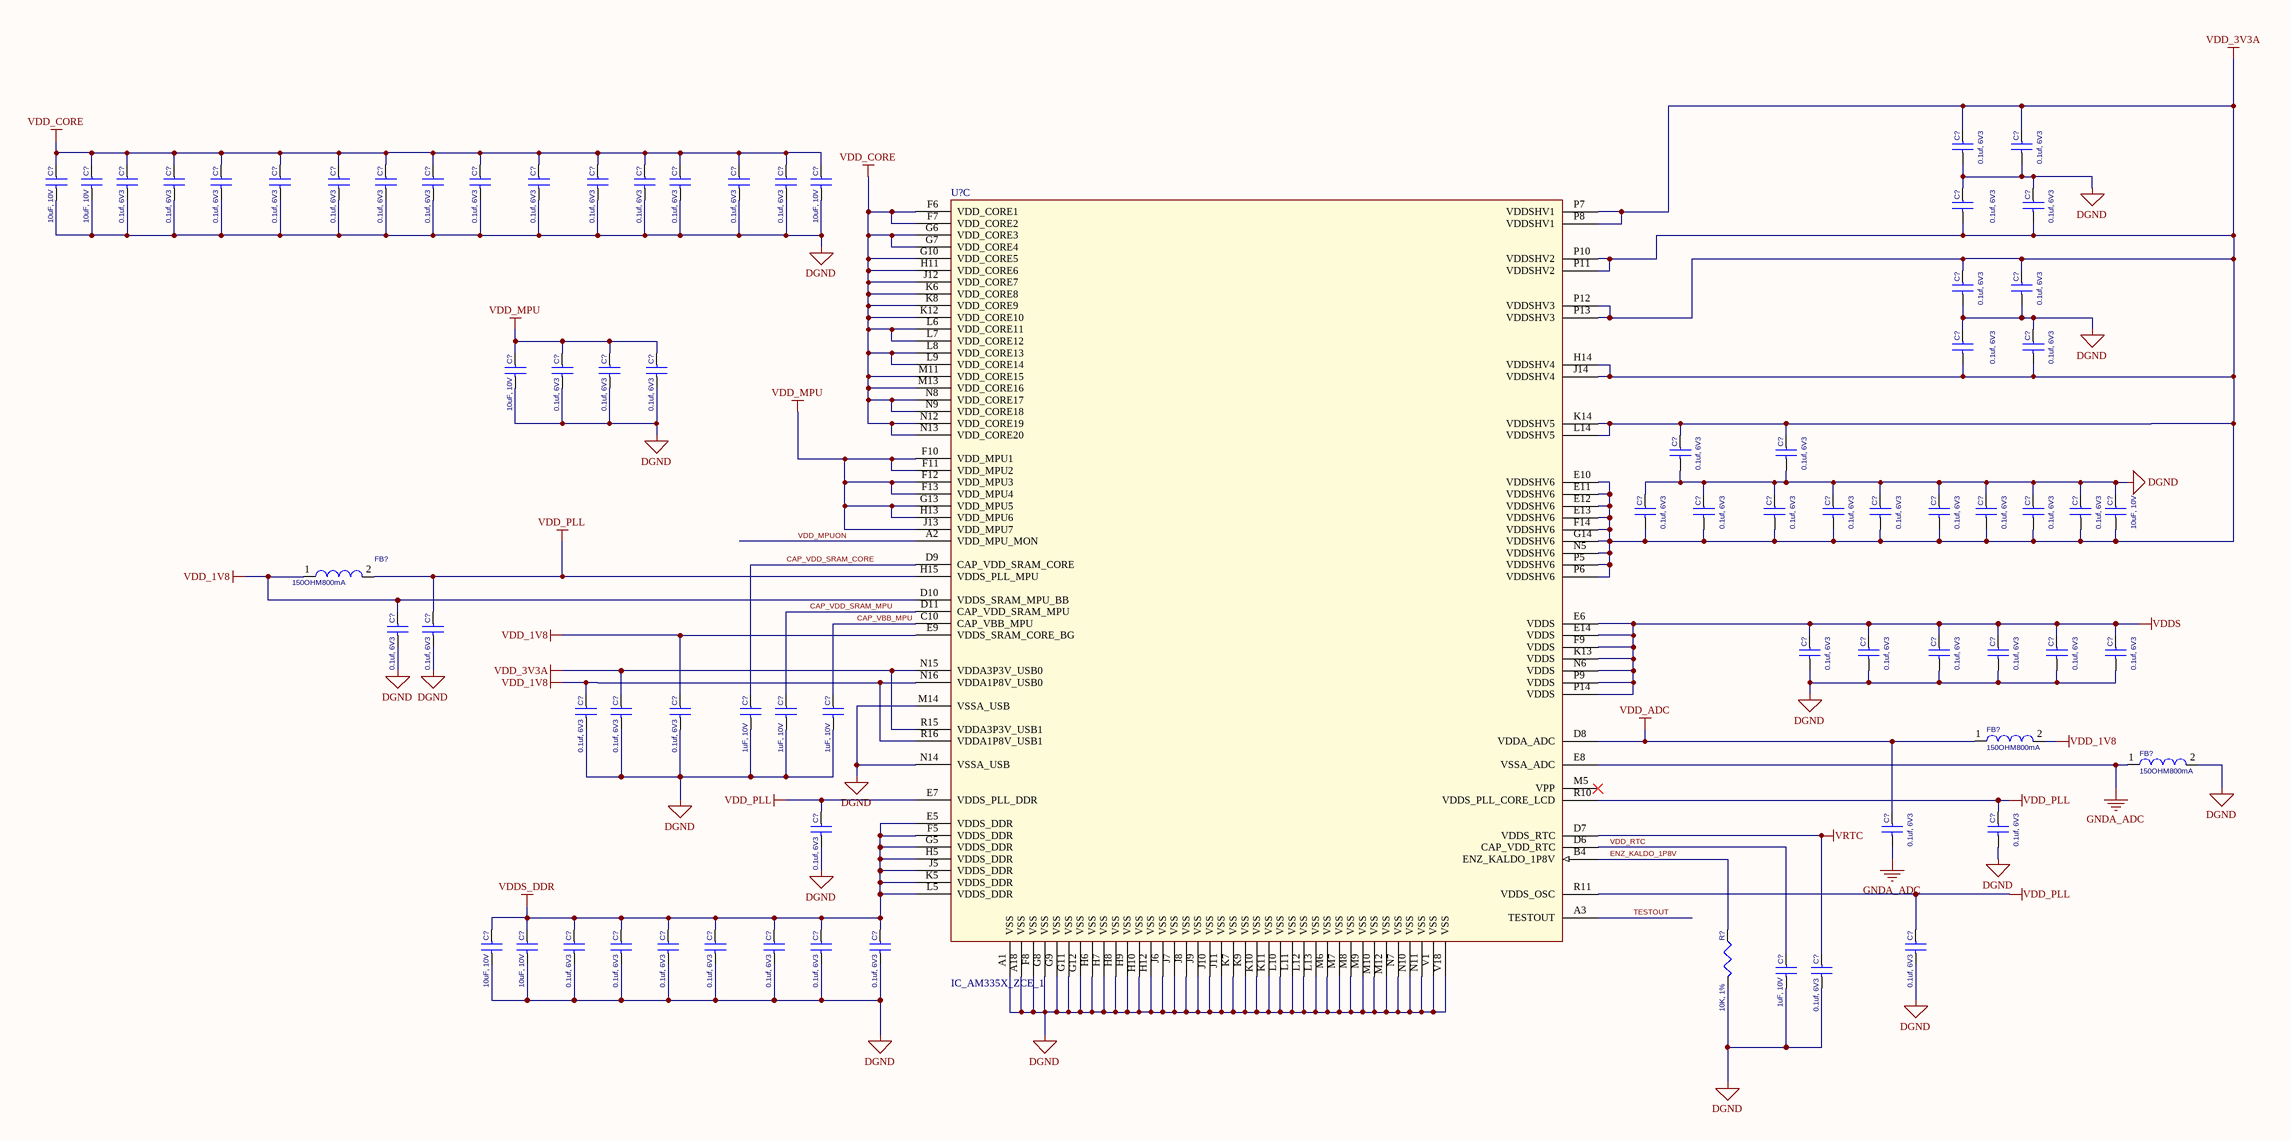
[diagram p5: p05_cpu_3_of_3.SchDoc]

### Parts
(Parts that share a designator on the sheet are numbered #1, #2 ... from top to bottom, then left to right.)
C?#38  0.1uf, 6V3  [402]
C?#39  0.1uf, 6V3  [402]
C?#40  10uF, 10V  [805]
C?#41  10uF, 10V  [805]
C?#42  0.1uf, 6V3  [402]
C?#43  0.1uf, 6V3  [402]
C?#44  0.1uf, 6V3  [402]
C?#45  0.1uf, 6V3  [402]
C?#46  0.1uf, 6V3  [402]
C?#47  0.1uf, 6V3  [402]
C?#48  0.1uf, 6V3  [402]
C?#49  0.1uf, 6V3  [402]
C?#50  0.1uf, 6V3  [402]
C?#51  0.1uf, 6V3  [402]
C?#52  0.1uf, 6V3  [402]
C?#53  0.1uf, 6V3  [402]
C?#54  0.1uf, 6V3  [402]
C?#55  0.1uf, 6V3  [402]
C?#56  10uF, 10V  [805]
C?#57  0.1uf, 6V3  [402]
C?#58  0.1uf, 6V3  [402]
C?#59  0.1uf, 6V3  [402]
C?#60  0.1uf, 6V3  [402]
C?#61  0.1uf, 6V3  [402]
C?#62  0.1uf, 6V3  [402]
C?#63  10uF, 10V  [805]
C?#64  0.1uf, 6V3  [402]
C?#65  0.1uf, 6V3  [402]
C?#66  0.1uf, 6V3  [402]
C?#67  0.1uf, 6V3  [402]
C?#68  0.1uf, 6V3  [402]
C?#69  0.1uf, 6V3  [402]
C?#70  0.1uf, 6V3  [402]
C?#71  0.1uf, 6V3  [402]
C?#72  0.1uf, 6V3  [402]
C?#73  0.1uf, 6V3  [402]
C?#74  0.1uf, 6V3  [402]
C?#75  0.1uf, 6V3  [402]
C?#76  0.1uf, 6V3  [402]
C?#77  0.1uf, 6V3  [402]
C?#78  10uF, 10V  [805]
C?#79  0.1uf, 6V3  [402]
C?#80  0.1uf, 6V3  [402]
C?#81  0.1uf, 6V3  [402]
C?#82  0.1uf, 6V3  [402]
C?#83  0.1uf, 6V3  [402]
C?#84  0.1uf, 6V3  [402]
C?#85  0.1uf, 6V3  [402]
C?#86  0.1uf, 6V3  [402]
C?#87  0.1uf, 6V3  [402]
C?#88  0.1uf, 6V3  [402]
C?#89  0.1uf, 6V3  [402]
C?#90  1uF, 10V  [402]
C?#91  1uF, 10V  [402]
C?#92  1uF, 10V  [402]
C?#93  0.1uf, 6V3  [402]
C?#94  0.1uf, 6V3  [402]
C?#95  0.1uf, 6V3  [402]
C?#96  10uF, 10V  [805]
C?#97  10uF, 10V  [805]
C?#98  0.1uf, 6V3  [402]
C?#99  0.1uf, 6V3  [402]
C?#100  0.1uf, 6V3  [402]
C?#101  0.1uf, 6V3  [402]
C?#102  0.1uf, 6V3  [402]
C?#103  0.1uf, 6V3  [402]
C?#104  0.1uf, 6V3  [402]
C?#105  0.1uf, 6V3  [402]
C?#106  1uF, 10V  [402]
C?#107  0.1uf, 6V3  [402]
FB?#4  150OHM800mA  [SM-7351-IND-0805]
FB?#5  150OHM800mA  [SM-7351-IND-0805]
FB?#6  150OHM800mA  [SM-7351-IND-0805]
R?#45  10K, 1%  [402]
U?#15  IC_AM335X_ZCE_1  [am33xx_15x15]  (part C of 3)

### Nets
DGND: C?#38.2 C?#39.2 C?#40.2 C?#41.2 C?#42.2 C?#43.2 C?#44.2 C?#45.2 C?#46.2 C?#47.2 C?#48.2 C?#49.2 C?#50.2 C?#51.2 C?#52.2 C?#53.2 C?#54.2 C?#55.2 C?#56.2 C?#57.1 C?#58.1 C?#59.2 C?#60.2 C?#61.1 C?#62.1 C?#63.2 C?#64.2 C?#65.2 C?#66.2 C?#67.2 C?#68.2 C?#69.1 C?#70.1 C?#71.1 C?#72.1 C?#73.1 C?#74.1 C?#75.1 C?#76.1 C?#77.1 C?#78.1 C?#79.2 C?#80.2 C?#81.2 C?#82.2 C?#83.2 C?#84.2 C?#85.2 C?#86.2 C?#87.2 C?#88.2 C?#89.2 C?#90.2 C?#91.2 C?#92.2 C?#93.2 C?#95.2 C?#96.2 C?#97.2 C?#98.2 C?#99.2 C?#100.2 C?#101.2 C?#102.2 C?#103.2 C?#104.2 C?#105.2 C?#106.2 C?#107.2 FB?#6.2 R?#45.2 U?#15.A1(VSS) U?#15.A18(VSS) U?#15.F8(VSS) U?#15.G8(VSS) U?#15.G9(VSS) U?#15.G11(VSS) U?#15.G12(VSS) U?#15.H6(VSS) U?#15.H7(VSS) U?#15.H8(VSS) U?#15.H9(VSS) U?#15.H10(VSS) U?#15.H12(VSS) U?#15.J6(VSS) U?#15.J7(VSS) U?#15.J8(VSS) U?#15.J9(VSS) U?#15.J10(VSS) U?#15.J11(VSS) U?#15.K7(VSS) U?#15.K9(VSS) U?#15.K10(VSS) U?#15.K11(VSS) U?#15.L10(VSS) U?#15.L11(VSS) U?#15.L12(VSS) U?#15.L13(VSS) U?#15.M6(VSS) U?#15.M7(VSS) U?#15.M8(VSS) U?#15.M9(VSS) U?#15.M10(VSS) U?#15.M12(VSS) U?#15.M14(VSSA_USB) U?#15.N7(VSS) U?#15.N10(VSS) U?#15.N11(VSS) U?#15.N14(VSSA_USB) U?#15.V1(VSS) U?#15.V18(VSS)
GNDA_ADC: C?#94.2 FB?#6.1 U?#15.E8(VSSA_ADC)
VDD_1V8: C?#79.1 C?#87.1 C?#89.1 FB?#4.1 FB?#5.2 U?#15.D10(VDDS_SRAM_MPU_BB) U?#15.E9(VDDS_SRAM_CORE_BG) U?#15.N16(VDDA1P8V_USB0) U?#15.R16(VDDA1P8V_USB1)
VDD_3V3A: C?#38.1 C?#39.1 C?#57.2 C?#58.2 C?#59.1 C?#60.1 C?#61.2 C?#62.2 C?#67.1 C?#68.1 C?#69.2 C?#70.2 C?#71.2 C?#72.2 C?#73.2 C?#74.2 C?#75.2 C?#76.2 C?#77.2 C?#78.2 C?#88.1 U?#15.E10(VDDSHV6) U?#15.E11(VDDSHV6) U?#15.E12(VDDSHV6) U?#15.E13(VDDSHV6) U?#15.F14(VDDSHV6) U?#15.G14(VDDSHV6) U?#15.H14(VDDSHV4) U?#15.J14(VDDSHV4) U?#15.K14(VDDSHV5) U?#15.L14(VDDSHV5) U?#15.N5(VDDSHV6) U?#15.N15(VDDA3P3V_USB0) U?#15.P5(VDDSHV6) U?#15.P6(VDDSHV6) U?#15.P7(VDDSHV1) U?#15.P8(VDDSHV1) U?#15.P10(VDDSHV2) U?#15.P11(VDDSHV2) U?#15.P12(VDDSHV3) U?#15.P13(VDDSHV3) U?#15.R15(VDDA3P3V_USB1)
VDD_ADC: C?#94.1 FB?#5.1 U?#15.D8(VDDA_ADC)
VDD_CORE: C?#40.1 C?#41.1 C?#42.1 C?#43.1 C?#44.1 C?#45.1 C?#46.1 C?#47.1 C?#48.1 C?#49.1 C?#50.1 C?#51.1 C?#52.1 C?#53.1 C?#54.1 C?#55.1 C?#56.1 U?#15.F6(VDD_CORE1) U?#15.F7(VDD_CORE2) U?#15.G6(VDD_CORE3) U?#15.G7(VDD_CORE4) U?#15.G10(VDD_CORE5) U?#15.H11(VDD_CORE6) U?#15.J12(VDD_CORE7) U?#15.K6(VDD_CORE8) U?#15.K8(VDD_CORE9) U?#15.K12(VDD_CORE10) U?#15.L6(VDD_CORE11) U?#15.L7(VDD_CORE12) U?#15.L8(VDD_CORE13) U?#15.L9(VDD_CORE14) U?#15.M11(VDD_CORE15) U?#15.M13(VDD_CORE16) U?#15.N8(VDD_CORE17) U?#15.N9(VDD_CORE18) U?#15.N12(VDD_CORE19) U?#15.N13(VDD_CORE20)
VDD_MPU: C?#63.1 C?#64.1 C?#65.1 C?#66.1 U?#15.F10(VDD_MPU1) U?#15.F11(VDD_MPU2) U?#15.F12(VDD_MPU3) U?#15.F13(VDD_MPU4) U?#15.G13(VDD_MPU5) U?#15.H13(VDD_MPU6) U?#15.J13(VDD_MPU7)
VDD_PLL: C?#80.1 C?#93.1 C?#95.1 C?#105.1 FB?#4.2 U?#15.E7(VDDS_PLL_DDR) U?#15.H15(VDDS_PLL_MPU) U?#15.R10(VDDS_PLL_CORE_LCD) U?#15.R11(VDDS_OSC)
VDDS: C?#81.1 C?#82.1 C?#83.1 C?#84.1 C?#85.1 C?#86.1 U?#15.E6(VDDS) U?#15.E14(VDDS) U?#15.F9(VDDS) U?#15.K13(VDDS) U?#15.N6(VDDS) U?#15.P9(VDDS) U?#15.P14(VDDS)
VDDS_DDR: C?#96.1 C?#97.1 C?#98.1 C?#99.1 C?#100.1 C?#101.1 C?#102.1 C?#103.1 C?#104.1 U?#15.E5(VDDS_DDR) U?#15.F5(VDDS_DDR) U?#15.G5(VDDS_DDR) U?#15.H5(VDDS_DDR) U?#15.J5(VDDS_DDR) U?#15.K5(VDDS_DDR) U?#15.L5(VDDS_DDR)
VRTC: C?#107.1 U?#15.D7(VDDS_RTC)
CAP_VBB_MPU: C?#92.1 U?#15.C10(CAP_VBB_MPU)
CAP_VDD_SRAM_CORE: C?#90.1 U?#15.D9(CAP_VDD_SRAM_CORE)
CAP_VDD_SRAM_MPU: C?#91.1 U?#15.D11(CAP_VDD_SRAM_MPU)
ENZ_KALDO_1P8V: R?#45.1 U?#15.B4(ENZ_KALDO_1P8V)
TESTOUT: U?#15.A3(TESTOUT)
VDD_MPUON: U?#15.A2(VDD_MPU_MON)
VDD_RTC: C?#106.1 U?#15.D6(CAP_VDD_RTC)

Not connected (* = marked no-connect by the designer): U?#15 M5(VPP)*

### Library data of the parts
C?#38 C?#39 C?#42-C?#55 C?#57-C?#62 C?#64-C?#77 C?#79-C?#89 C?#93-C?#95 C?#98-C?#105 C?#107 = CAP_0.1uF_X7R_16V_10% 0402: as C?#29 on sheet p04_cpu_2_of_3_usb_serial; Applications: General Purpose; Category: Capacitors; ComponentLink1Description: http://www.kemet.com/datasheets&C0402C104K4RACTU; ComponentLink1URL: http://www.kemet.com/datasheets&C0402C104K4RACTU; Features: -; Height - Seated (Max): -; Lead Spacing: -; Lead Style: -; Mounting Type: Surface Mount, MLCC; Operating Temperature: -55°C ~ 85°C; Package / Case: 0402 (1005 Metric); Packaging: Digi-Reel®; Pricing 1: 1=0.1, 10=0.026, 100=0.0121, 250=0.00992, 500=0.00848, 1000=0.0066, 5000=0.0055 (USD); Ratings: -; RoHS: RoHS Compliant; Size / Dimension: 0.039" L x 0.020" W (1.00mm x 0.50mm); Stock 1: 127604; Supplier 1: Digi-Key; Supplier Part Number 1: 445-1266-6-ND; Temperature Coefficient: X5R; Thickness (Max): 0.022" (0.55mm); Tolerance: ±10%; Voltage - Rated: 6.3V
C?#40 C?#41 C?#56 C?#63 C?#78 C?#96 C?#97 = CAP_10uF_Y5V_10V_10%_0805: as C?#33 on sheet p04_cpu_2_of_3_usb_serial; Supplier 1: Digi-Key; Supplier Part Number 1: 445-1371-6-ND; RoHS: RoHS Compliant; Category: Capacitors; Stock 1: 123307; Pricing 1: 1=0.15, 10=0.105, 100=0.0499, 250=0.042, 500=0.03518, 1000=0.02887 (USD); Voltage - Rated: 10V; Mounting Type: Surface Mount, MLCC; Operating Temperature: -30°C ~ 85°C; Applications: General Purpose; Ratings: -; Package / Case: 0805 (2012 Metric); Size / Dimension: 0.079" L x 0.049" W (2.00mm x 1.25mm); Height - Seated (Max): -; Thickness (Max): 0.057" (1.45mm); Lead Spacing: -; Features: -; Packaging: Digi-Reel®; Lead Style: -; ComponentLink1URL: http://media.digikey.com/pdf/Data%20Sheets/TDK%20PDFs/C_Series_GeneralAppl_B11.pdf; ComponentLink1Description: http://media.digikey.com/pdf/Data%20Sheets/TDK%20PDFs/C_Series_GeneralAppl_B11.pdf
C?#90-C?#92 C?#106 = CAP_1.0UF_X5R_10V_10%_0402: CAP CER 1UF 10V 10% X5R 0402; Manufacturer: AVX Corporation; Manufacturer Part Number: 0402ZD105KAT2A; Capacitance: 1.0µF; Applications: General Purpose; Category: Capacitors; ComponentLink1Description: http://www.avx.com/docs/Catalogs/cx5r.pdf; ComponentLink1URL: http://www.avx.com/docs/Catalogs/cx5r.pdf; Features: -; Height - Seated (Max): -; Lead Spacing: -; Lead Style: -; Mounting Type: Surface Mount, MLCC; Operating Temperature: -55°C ~ 85°C; Package / Case: 0402 (1005 Metric); Packaging: Digi-Reel®; Pricing 1: 1=0.3, 10=0.25, 100=0.125, 250=0.09376, 500=0.08282, 1000=0.07344, 5000=0.06094 (USD); Ratings: -; RoHS: RoHS Compliant; Size / Dimension: 0.039" L x 0.020" W (1.00mm x 0.50mm); Stock 1: 409277; Supplier 1: Digi-Key; Supplier Part Number 1: 478-4596-6-ND; Temperature Coefficient: X5R; Thickness (Max): 0.022" (0.56mm); Tolerance: ±10%; Voltage - Rated: 10V
FB?#4-FB?#6 = FER_180_200_0: as FB?#1 on sheet p04_cpu_2_of_3_usb_serial; Supplier 1: Digi-Key; Supplier Part Number 1: 240-2384-6-ND; Manufacturer Part Number: LI0805H151R-10; RoHS: RoHS Compliant; Category: Filters; Stock 1: 3694; Pricing 1: 1=0.1, 10=0.07, 25=0.064, 50=0.0574, 100=0.0421, 250=0.03064, 500=0.02808, 1000=0.02424 (USD); Current Rating: 800mA; Package / Case: 0805 (2012 Metric); Mounting Type: Surface Mount; Packaging: Digi-Reel®; Height (Max): 0.043" (1.10mm); Size / Dimension: 0.079" L x 0.049" W (2.00mm x 1.25mm); ComponentLink1URL: http://www.lairdtech.com/WorkArea/linkit.aspx?LinkIdentifier=id&ItemID=4912; ComponentLink1Description: http://www.lairdtech.com/WorkArea/linkit.aspx?LinkIdentifier=id&ItemID=4912
R?#45 = RES_10K_1/16W_1%_0402: as R?#41 on sheet p04_cpu_2_of_3_usb_serial; Supplier 1: Digi-Key; Supplier Part Number 1: RHM10KJDKR-ND; RoHS: RoHS Compliant; Category: Resistors; Stock 1: 110842; Pricing 1: 1=0.1, 10=0.019, 25=0.014, 100=0.0078, 250=0.00596, 500=0.00476, 1000=0.0035, 5000=0.00251 (USD); Resistance (Ohms): 10k; Composition: Thick Film; Features: Automotive AEC-Q200 Qualified; Tolerance: ±5%; Package / Case: 0402 (1005 Metric); Supplier Device Package: 0402 (1005 Metric); Size / Dimension: 0.039" L x 0.020" W (1.00mm x 0.50mm); Height: 0.016" (0.40mm); Number of Terminations: 2; Packaging: Digi-Reel®; ComponentLink1URL: http://rohmfs.rohm.com/en/products/databook/datasheet/passive/resistor/chip_resistor/mcr_a.pdf; ComponentLink1Description: http://rohmfs.rohm.com/en/products/databook/datasheet/passive/resistor/chip_resistor/mcr_a.pdf
U?#15 = IC_AM335X_ZCE_1: as U?#6 on sheet p04_cpu_2_of_3_usb_serial; Supplier 1: Digi-Key; Supplier Part Number 1: 296-35073-ND; RoHS: RoHS Compliant; Category: Integrated Circuits (ICs); Stock 1: 16; Pricing 1: 1=33.5, 10=30.988, 100=26.465, 250=24.28752, 500=23.115, 1000=21.775, 2500=21.105, 5000=20.6025, 10000=20.1 (USD); Features: -; Speed: -; Mounting Type: Surface Mount; Package / Case: 324-LFBGA; Supplier Device Package: 324-NFBGA(15x15); Packaging: Tray; ComponentLink1URL: http://www.ti.com/lit/ds/symlink/am3354.pdf; ComponentLink1Description: http://www.ti.com/lit/ds/symlink/am3354.pdf

## Sheet p06_led_config_button.SchDoc
size 386 x 246 mm
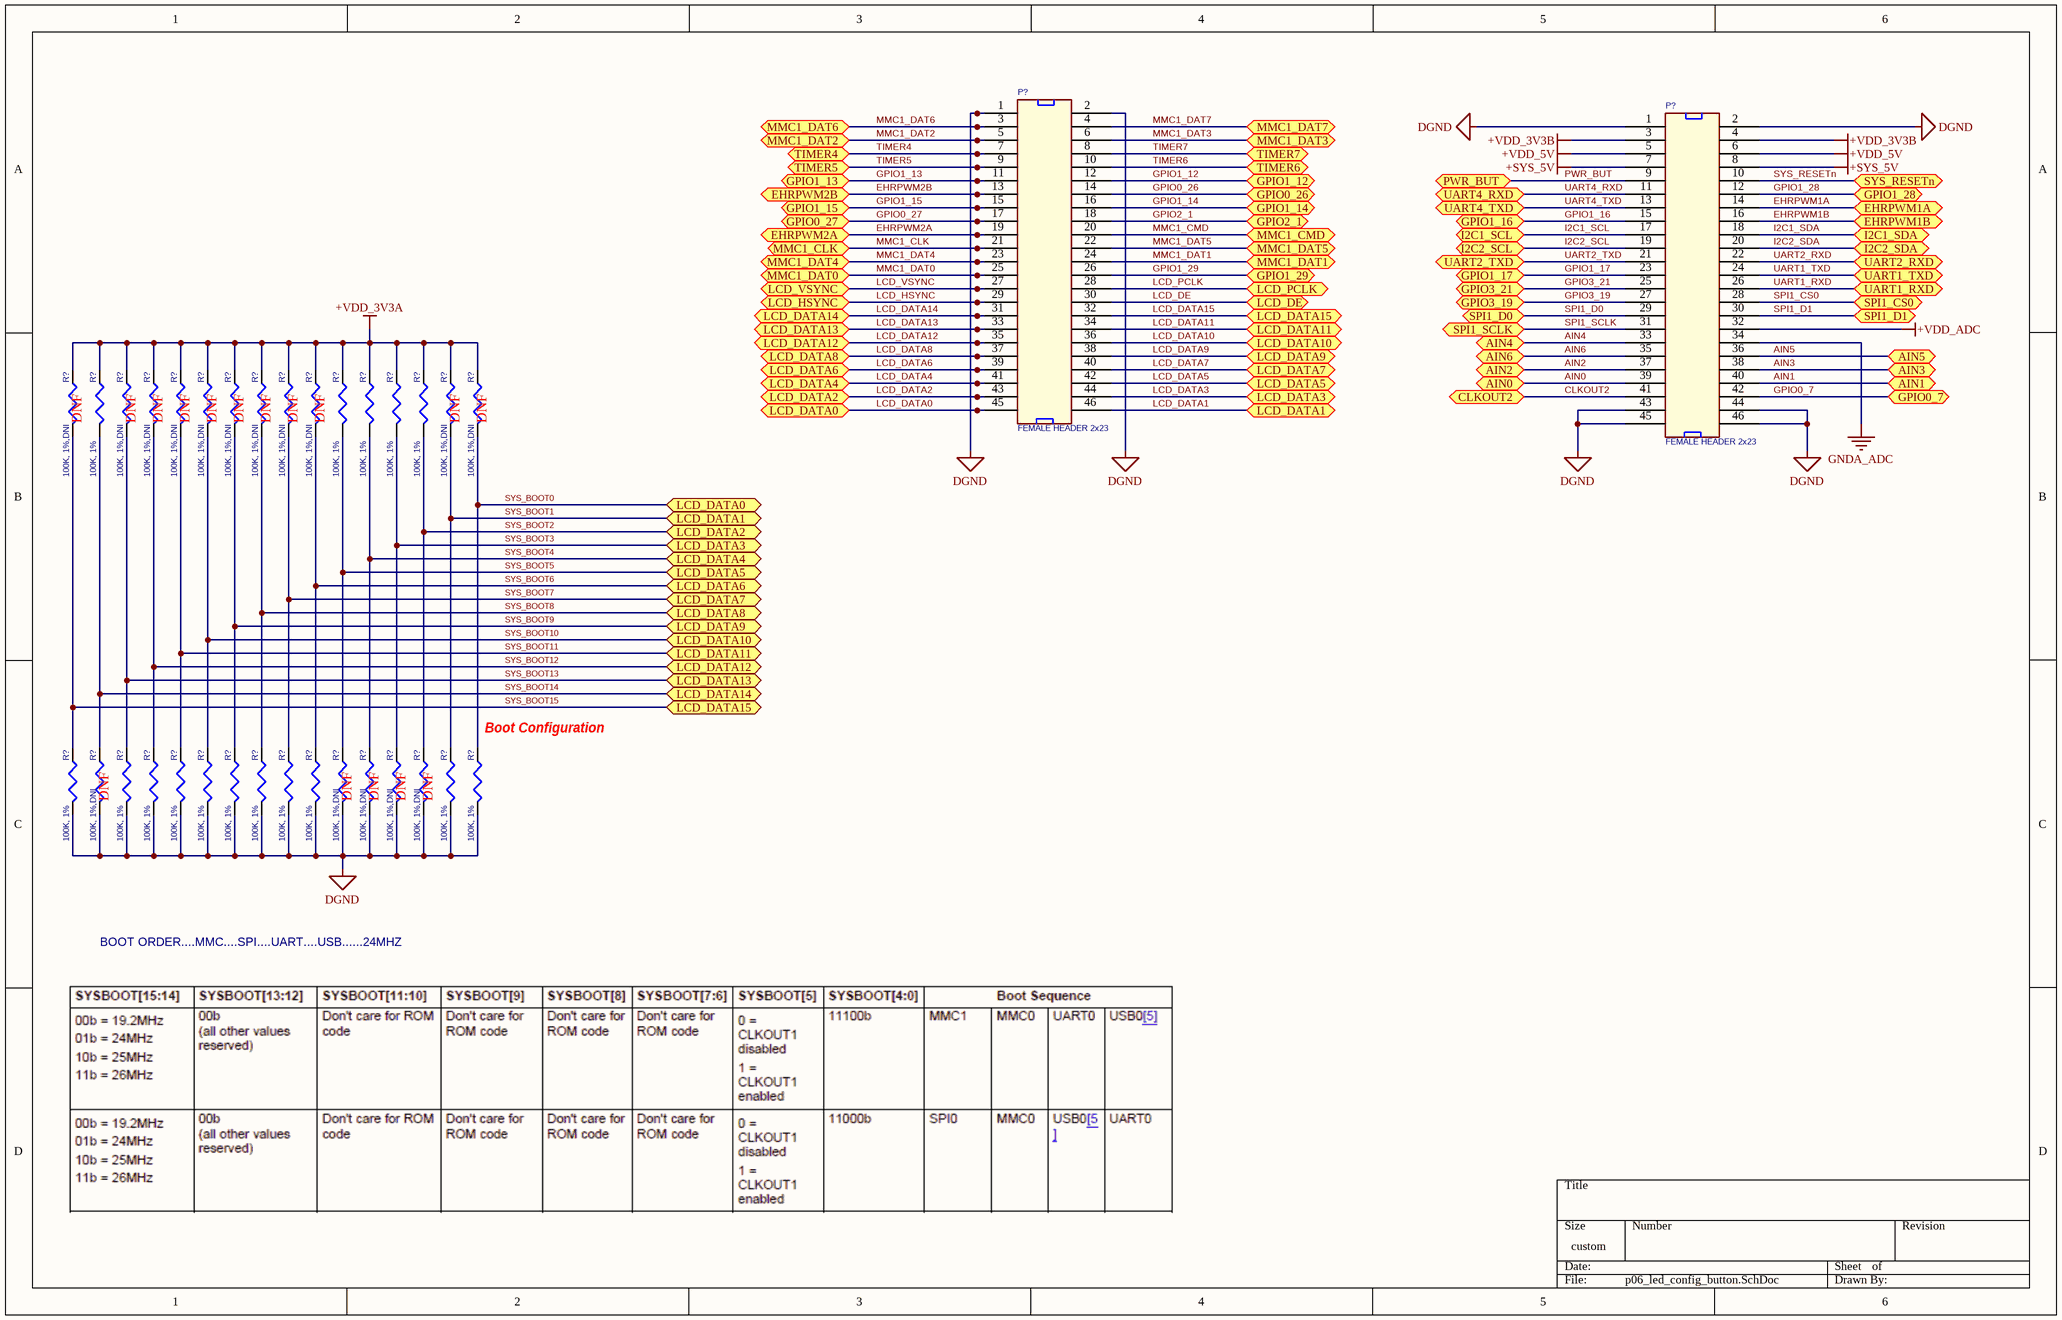
[diagram p6: p06_led_config_button.SchDoc]

### Parts
(Parts that share a designator on the sheet are numbered #1, #2 ... from top to bottom, then left to right.)
P?#6  FEMALE HEADER 2x23  [HEADER23X2]
P?#7  FEMALE HEADER 2x23  [HEADER23X2]
R?#46  100K, 1%,DNI  [402]
R?#47  100K, 1%  [402]
R?#48  100K, 1%,DNI  [402]
R?#49  100K, 1%,DNI  [402]
R?#50  100K, 1%,DNI  [402]
R?#51  100K, 1%,DNI  [402]
R?#52  100K, 1%,DNI  [402]
R?#53  100K, 1%,DNI  [402]
R?#54  100K, 1%,DNI  [402]
R?#55  100K, 1%,DNI  [402]
R?#56  100K, 1%  [402]
R?#57  100K, 1%  [402]
R?#58  100K, 1%  [402]
R?#59  100K, 1%  [402]
R?#60  100K, 1%,DNI  [402]
R?#61  100K, 1%,DNI  [402]
R?#62  100K, 1%  [402]
R?#63  100K, 1%,DNI  [402]
R?#64  100K, 1%  [402]
R?#65  100K, 1%  [402]
R?#66  100K, 1%  [402]
R?#67  100K, 1%  [402]
R?#68  100K, 1%  [402]
R?#69  100K, 1%  [402]
R?#70  100K, 1%  [402]
R?#71  100K, 1%  [402]
R?#72  100K, 1%,DNI  [402]
R?#73  100K, 1%,DNI  [402]
R?#74  100K, 1%,DNI  [402]
R?#75  100K, 1%,DNI  [402]
R?#76  100K, 1%  [402]
R?#77  100K, 1%  [402]

### Ports
AIN0, AIN1, AIN2, AIN3, AIN4, AIN5, AIN6, CLKOUT2, EHRPWM1A, EHRPWM1B, EHRPWM2A, EHRPWM2B, GPIO0_7, GPIO0_26, GPIO0_27, GPIO1_12, GPIO1_13, GPIO1_14, GPIO1_15, GPIO1_16, GPIO1_17, GPIO1_28, GPIO1_29, GPIO2_1, GPIO3_19, GPIO3_21, I2C1_SCL, I2C1_SDA, I2C2_SCL, I2C2_SDA, LCD_DATA0, LCD_DATA1, LCD_DATA2, LCD_DATA3, LCD_DATA4, LCD_DATA5, LCD_DATA6, LCD_DATA7, LCD_DATA8, LCD_DATA9, LCD_DATA10, LCD_DATA11, LCD_DATA12, LCD_DATA13, LCD_DATA14, LCD_DATA15, LCD_DE, LCD_HSYNC, LCD_PCLK, LCD_VSYNC, MMC1_CLK, MMC1_CMD, MMC1_DAT0, MMC1_DAT1, MMC1_DAT2, MMC1_DAT3, MMC1_DAT4, MMC1_DAT5, MMC1_DAT6, MMC1_DAT7, PWR_BUT, SPI1_CS0, SPI1_D0, SPI1_D1, SPI1_SCLK, SYS_RESETn, TIMER4, TIMER5, TIMER6, TIMER7, UART1_RXD, UART1_TXD, UART2_RXD, UART2_TXD, UART4_RXD, UART4_TXD

### Nets
+SYS_5V: P?#7.7 P?#7.8
+VDD_3V3A: R?#46.1 R?#47.1 R?#48.1 R?#49.1 R?#50.1 R?#51.1 R?#52.1 R?#53.1 R?#54.1 R?#55.1 R?#56.1 R?#57.1 R?#58.1 R?#59.1 R?#60.1 R?#61.1
+VDD_3V3B: P?#7.3 P?#7.4
+VDD_5V: P?#7.5 P?#7.6
+VDD_ADC: P?#7.32
DGND: P?#6.1 P?#6.2 P?#7.1 P?#7.2 P?#7.43 P?#7.44 P?#7.45 P?#7.46 R?#62.2 R?#63.2 R?#64.2 R?#65.2 R?#66.2 R?#67.2 R?#68.2 R?#69.2 R?#70.2 R?#71.2 R?#72.2 R?#73.2 R?#74.2 R?#75.2 R?#76.2 R?#77.2
GNDA_ADC: P?#7.34
AIN0: P?#7.39 ; port AIN0
AIN1: P?#7.40 ; port AIN1
AIN2: P?#7.37 ; port AIN2
AIN3: P?#7.38 ; port AIN3
AIN4: P?#7.33 ; port AIN4
AIN5: P?#7.36 ; port AIN5
AIN6: P?#7.35 ; port AIN6
CLKOUT2: P?#7.41 ; port CLKOUT2
EHRPWM1A: P?#6.24 P?#7.14 ; port MMC1_DAT1, port EHRPWM1A  [also labelled MMC1_DAT1]
EHRPWM1B: P?#6.5 P?#7.16 ; port MMC1_DAT2, port EHRPWM1B  [also labelled MMC1_DAT2]
EHRPWM2A: P?#6.19 ; port EHRPWM2A
EHRPWM2B: P?#6.13 ; port EHRPWM2B
GPIO0_7: P?#7.42 ; port GPIO0_7
GPIO0_26: P?#6.14 ; port GPIO0_26
GPIO0_27: P?#6.17 ; port GPIO0_27
GPIO1_12: P?#6.12 ; port GPIO1_12
GPIO1_13: P?#6.11 ; port GPIO1_13
GPIO1_14: P?#6.16 ; port GPIO1_14
GPIO1_15: P?#6.15 ; port GPIO1_15
GPIO1_16: P?#7.15 ; port GPIO1_16
GPIO1_17: P?#7.23 ; port GPIO1_17
GPIO1_28: P?#7.12 ; port GPIO1_28
GPIO1_29: P?#6.26 ; port GPIO1_29
GPIO2_1: P?#6.18 ; port GPIO2_1
GPIO3_19: P?#7.27 ; port GPIO3_19
GPIO3_21: P?#7.25 ; port GPIO3_21
I2C1_SCL: P?#7.17 ; port I2C1_SCL
I2C1_SDA: P?#7.18 ; port I2C1_SDA
I2C2_SCL: P?#7.19 ; port I2C2_SCL
I2C2_SDA: P?#7.20 ; port I2C2_SDA
LCD_DATA0: P?#6.45 R?#61.2 R?#77.1 ; port LCD_DATA0  [also labelled SYS_BOOT0]
LCD_DATA1: P?#6.46 R?#60.2 R?#76.1 ; port LCD_DATA1  [also labelled SYS_BOOT1]
LCD_DATA2: P?#6.43 R?#59.2 R?#75.1 ; port LCD_DATA2  [also labelled SYS_BOOT2]
LCD_DATA3: P?#6.44 R?#58.2 R?#74.1 ; port LCD_DATA3  [also labelled SYS_BOOT3]
LCD_DATA4: P?#6.41 R?#57.2 R?#73.1 ; port LCD_DATA4  [also labelled SYS_BOOT4]
LCD_DATA5: P?#6.42 R?#56.2 R?#72.1 ; port LCD_DATA5  [also labelled SYS_BOOT5]
LCD_DATA6: P?#6.39 R?#55.2 R?#71.1 ; port LCD_DATA6  [also labelled SYS_BOOT6]
LCD_DATA7: P?#6.40 R?#54.2 R?#70.1 ; port LCD_DATA7  [also labelled SYS_BOOT7]
LCD_DATA8: P?#6.37 R?#53.2 R?#69.1 ; port LCD_DATA8  [also labelled SYS_BOOT8]
LCD_DATA9: P?#6.38 R?#52.2 R?#68.1 ; port LCD_DATA9  [also labelled SYS_BOOT9]
LCD_DATA10: P?#6.36 R?#51.2 R?#67.1 ; port LCD_DATA10  [also labelled SYS_BOOT10]
LCD_DATA11: P?#6.34 R?#50.2 R?#66.1 ; port LCD_DATA11  [also labelled SYS_BOOT11]
LCD_DATA12: P?#6.35 R?#49.2 R?#65.1 ; port LCD_DATA12  [also labelled SYS_BOOT12]
LCD_DATA13: P?#6.33 R?#48.2 R?#64.1 ; port LCD_DATA13  [also labelled SYS_BOOT13]
LCD_DATA14: P?#6.31 R?#47.2 R?#63.1 ; port LCD_DATA14  [also labelled SYS_BOOT14]
LCD_DATA15: P?#6.32 R?#46.2 R?#62.1 ; port LCD_DATA15  [also labelled SYS_BOOT15]
LCD_DE: P?#6.30 ; port LCD_DE
LCD_HSYNC: P?#6.29 ; port LCD_HSYNC
LCD_PCLK: P?#6.28 ; port LCD_PCLK
LCD_VSYNC: P?#6.27 ; port LCD_VSYNC
MMC1_CLK: P?#6.21 ; port MMC1_CLK
MMC1_CMD: P?#6.20 ; port MMC1_CMD
MMC1_DAT0: P?#6.25 ; port MMC1_DAT0
MMC1_DAT3: P?#6.6 ; port MMC1_DAT3
MMC1_DAT4: P?#6.23 ; port MMC1_DAT4
MMC1_DAT5: P?#6.22 ; port MMC1_DAT5
MMC1_DAT6: P?#6.3 ; port MMC1_DAT6
MMC1_DAT7: P?#6.4 ; port MMC1_DAT7
PWR_BUT: P?#7.9 ; port PWR_BUT
SPI1_CS0: P?#7.28 ; port SPI1_CS0
SPI1_D0: P?#7.29 ; port SPI1_D0
SPI1_D1: P?#7.30 ; port SPI1_D1
SPI1_SCLK: P?#7.31 ; port SPI1_SCLK
SYS_RESETn: P?#7.10 ; port SYS_RESETn
TIMER4: P?#6.7 ; port TIMER4
TIMER5: P?#6.9 ; port TIMER5
TIMER6: P?#6.10 ; port TIMER6
TIMER7: P?#6.8 ; port TIMER7
UART1_RXD: P?#7.26 ; port UART1_RXD
UART1_TXD: P?#7.24 ; port UART1_TXD
UART2_RXD: P?#7.22 ; port UART2_RXD
UART2_TXD: P?#7.21 ; port UART2_TXD
UART4_RXD: P?#7.11 ; port UART4_RXD
UART4_TXD: P?#7.13 ; port UART4_TXD

### Notes on the sheet
- (near R?#46) DNF
- (near R?#48) DNF
- (near R?#49) DNF
- (near R?#50) DNF
- (near R?#51) DNF
- (near R?#52) DNF
- (near R?#53) DNF
- (near R?#54) DNF
- (near R?#55) DNF
- (near R?#60) DNF
- (near R?#61) DNF
- (near R?#77) Boot Configuration
- (near R?#63) DNF
- (near R?#72) DNF
- (near R?#73) DNF
- (near R?#74) DNF
- (near R?#75) DNF
- BOOT ORDER....MMC....SPI....UART....USB......24MHZ

### Library data of the parts
P?#6 P?#7 = HDR_46_F_2_0.1_0.1: CONN HEADER FMAL 46PS.1" DL GOLD; Manufacturer: Sullins Connector Solutions; Manufacturer Part Number: PPPC232LFBN-RC; Number of Positions: 46; Number of Positions Loaded: All; Pitch: 0.100" (2.54mm); Supplier 1: Digi-Key; Supplier Part Number 1: S7126-ND; RoHS: RoHS Compliant; Category: Connectors, Interconnects; Stock 1: 750; Pricing 1: 1=2.75, 10=2.325, 25=2.2196, 50=2.0084, 100=1.7969, 250=1.58552, 500=1.4798, 1000=1.3741, 2500=1.32125 (USD); Connector Type: Header; Contact Type: Female Socket; Number of Rows: 2; Row Spacing: 0.100" (2.54mm); Mounting Type: Through Hole; Termination: Solder; Fastening Type: -; Features: -; Contact Finish: Gold; Contact Finish Thickness: Flash; Color: Black; Packaging: Bulk; ComponentLink1URL: http://www.sullinscorp.com/drawings/78_P(N)PxCxxxLFBN-RC,_10492-G.pdf; ComponentLink1Description: http://www.sullinscorp.com/drawings/78_P(N)PxCxxxLFBN-RC,_10492-G.pdf
R?#46-R?#77 = RES_100K_1/16W_1%_0402: RES 100K OHM 1/16W 1% 0402 SMD; Manufacturer: Stackpole Electronics Inc; Manufacturer Part Number: RMCF0402FT100K; Power (Watts): 0.063W, 1/16W; Temperature Coefficient: ±100ppm/°C; Category: Resistors; ComponentLink1Description: http://www.seielect.com/Catalog/SEI-RMCF_RMCP.pdf; ComponentLink1URL: http://www.seielect.com/Catalog/SEI-RMCF_RMCP.pdf; Composition: Thick Film; Features: -; Height: 0.016" (0.40mm); Number of Terminations: 2; Package / Case: 0402 (1005 Metric); Packaging: Digi-Reel®; Pricing 1: 1=0.04, 10=0.025, 50=0.0138, 100=0.0105, 250=0.0078, 500=0.00576, 1000=0.00384, 2500=0.00324, 5000=0.0027 (USD); Resistance (Ohms): 100k; RoHS: RoHS Compliant; Size / Dimension: 0.039" L x 0.020" W (1.00mm x 0.50mm); Stock 1: 851196; Supplier 1: Digi-Key; Supplier Device Package: 0402; Supplier Part Number 1: RMCF0402FT100KDKR-ND; Tolerance: ±1%